# EAGLE design smartInterface_org (EAGLE 9.5.0)

## Sheet 1 of 5: Microcontroller Subsystem
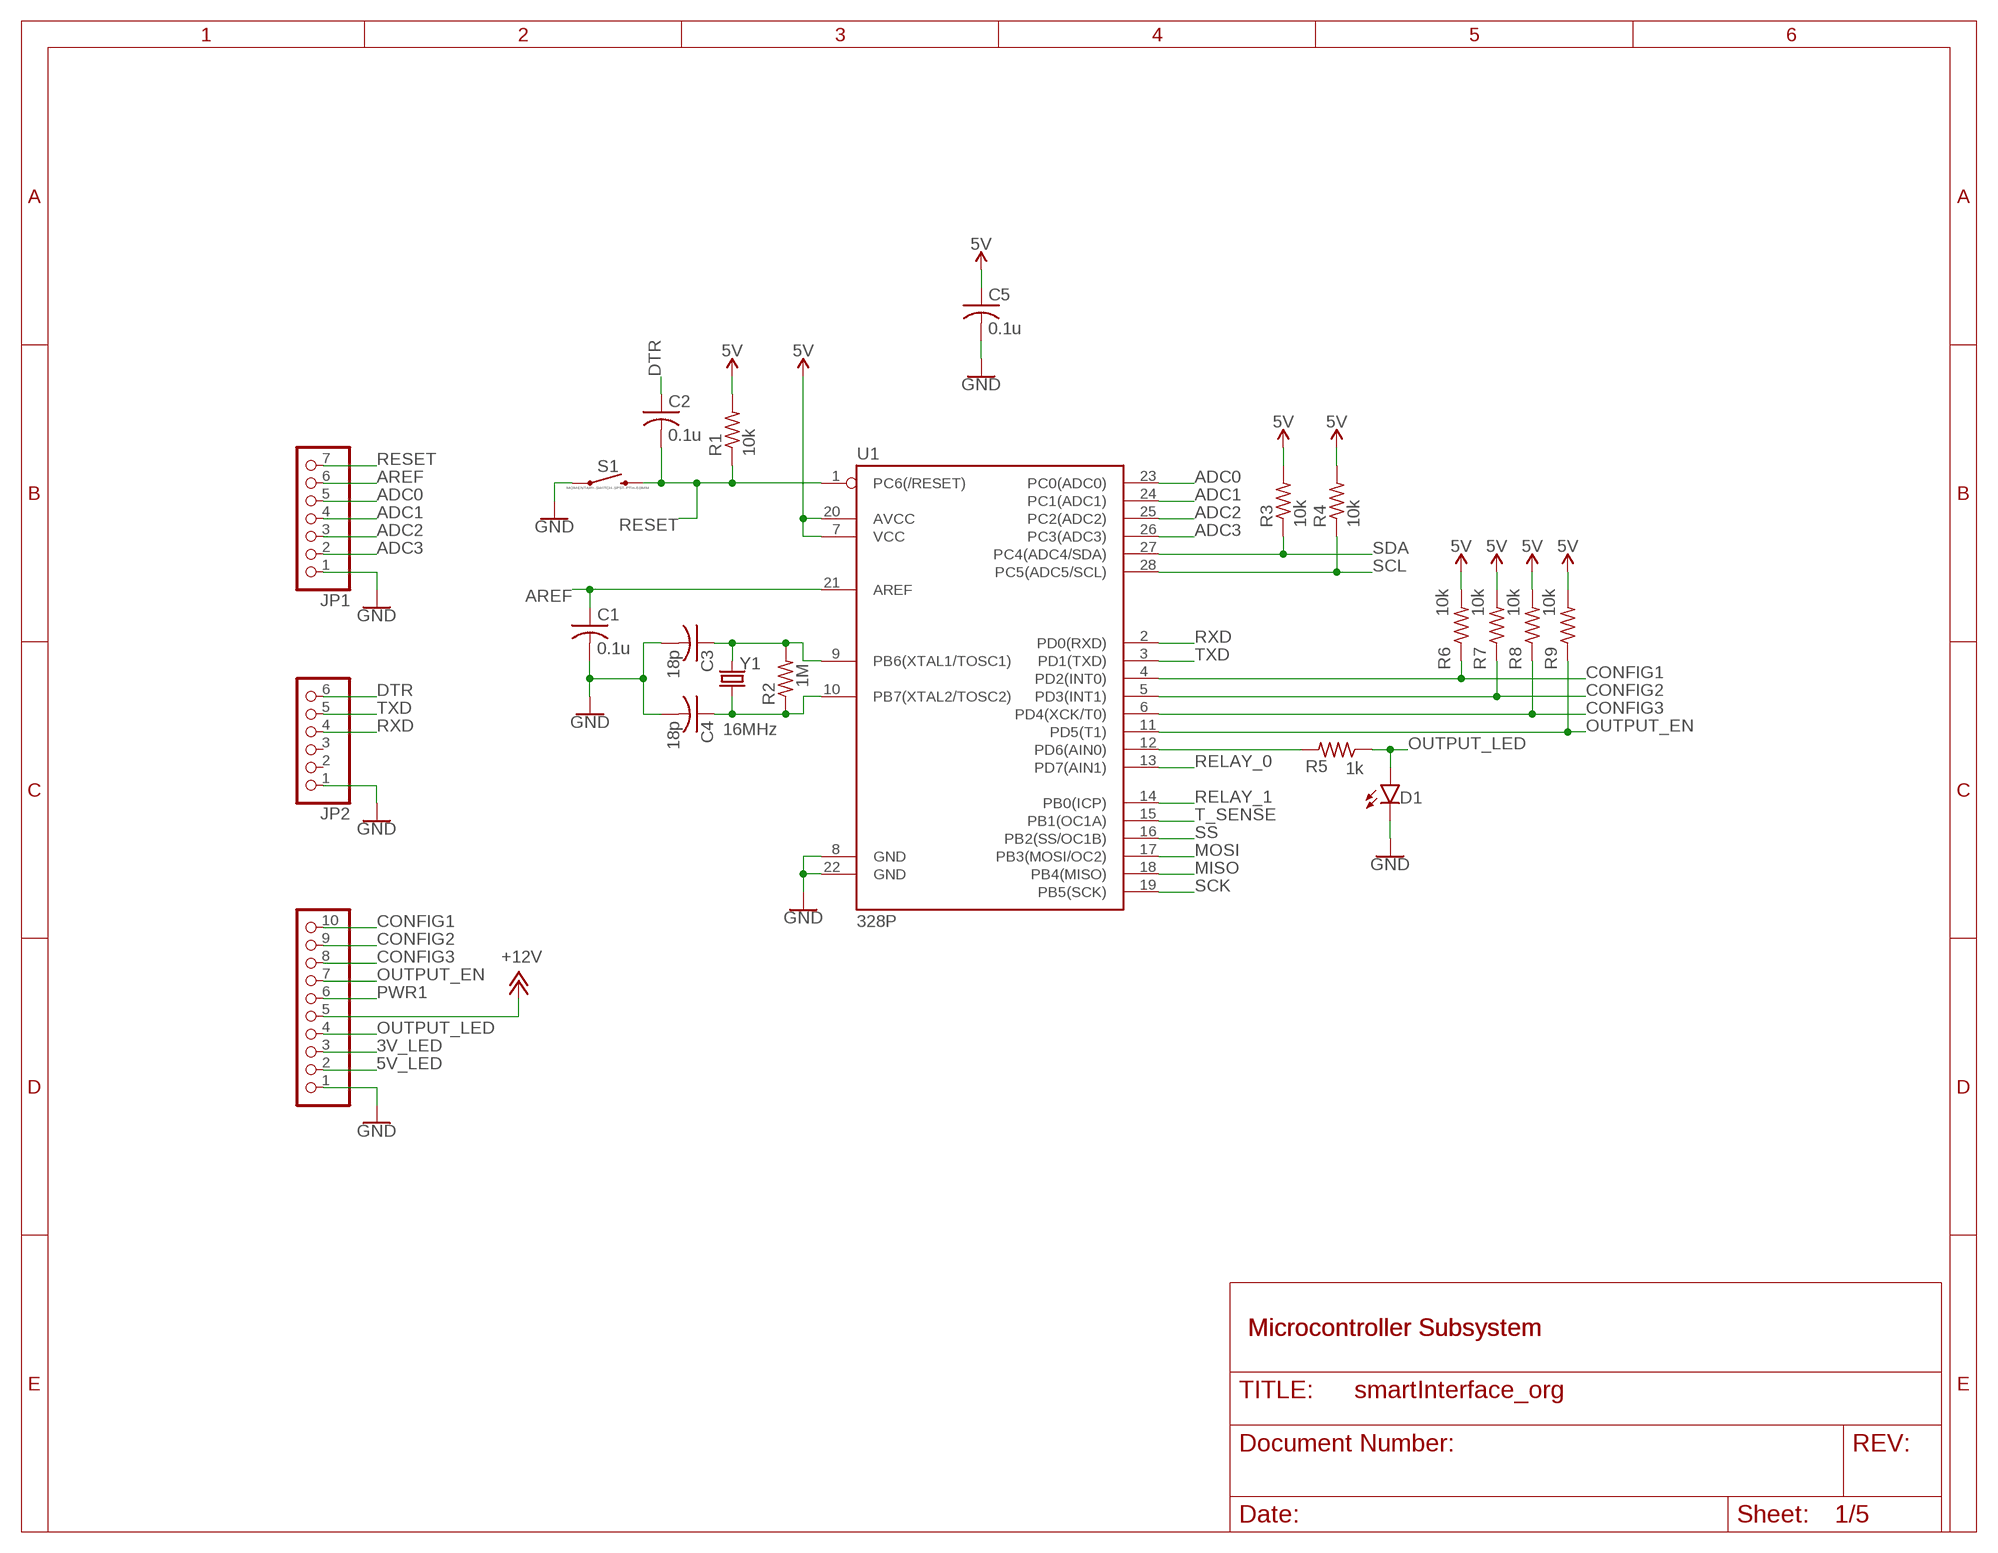
[diagram p0: schematic, sheet 1]

### Parts
C1  0.1u  C-USC0603  [C0603]
C2  0.1u  C-USC0603  [C0603]
C3  18p  C-USC0603  [C0603]
C4  18p  C-USC0603  [C0603]
C5  0.1u  C-USC0603  [C0603]
D1  LED0603  [LED-0603]
JP1  PINHD-1X7  [1X07]
JP2  PINHD-1X6/90  [1X06/90]
JP5  PINHD-1X10  [1X10]
R1  10k  R-US_R0603  [R0603]
R2  1M  R-US_R0603  [R0603]
R3  10k  R-US_R0603  [R0603]
R4  10k  R-US_R0603  [R0603]
R5  1k  R-US_R0603  [R0603]
R6  10k  R-US_R0603  [R0603]
R7  10k  R-US_R0603  [R0603]
R8  10k  R-US_R0603  [R0603]
R9  10k  R-US_R0603  [R0603]
S1  MOMENTARY-SWITCH-SPST-PTH-6.0MM  [TACTILE_SWITCH_PTH_6.0MM]
U1  328P  ATMEGA328P_PDIP  [DIP28]
Y1  16MHz  CRYSTAL-16MHZPTH-HC49US  [HC49US]

### Nets
3V_LED: JP5.3 ; also sheet 5
5V: C5.1 R1.2 R3.2 R4.2 R6.2 R7.2 R8.2 R9.2 U1.7(VCC) U1.20(AVCC) ; also sheet 3,4,5
5V_LED: JP5.2 ; also sheet 5
+12V: JP5.5 ; also sheet 5
ADC0: JP1.5 U1.23(PC0(ADC0))
ADC1: JP1.4 U1.24(PC1(ADC1))
ADC2: JP1.3 U1.25(PC2(ADC2))
ADC3: JP1.2 U1.26(PC3(ADC3))
AREF: C1.1 JP1.6 U1.21(AREF)
CONFIG1: JP5.10 R6.1 U1.4(PD2(INT0))
CONFIG2: JP5.9 R7.1 U1.5(PD3(INT1))
CONFIG3: JP5.8 R8.1 U1.6(PD4(XCK/T0))
DTR: C2.1 JP2.6
GND: C1.2 C3.2 C4.2 C5.2 D1.C JP1.1 JP2.1 JP5.1 S1.1 U1.8(GND) U1.22(GND) ; also sheet 2,3,4,5
MISO: U1.18(PB4(MISO)) ; also sheet 4
MOSI: U1.17(PB3(MOSI/OC2)) ; also sheet 4
N$6: C3.1 R2.2 U1.9(PB6(XTAL1/TOSC1)) Y1.2
N$8: C4.1 R2.1 U1.10(PB7(XTAL2/TOSC2)) Y1.1
N$9: R5.2 U1.12(PD6(AIN0))
OUTPUT_EN: JP5.7 R9.1 U1.11(PD5(T1))
OUTPUT_LED: D1.A JP5.4 R5.1
PWR1: JP5.6 ; also sheet 5
RELAY_0: U1.13(PD7(AIN1)) ; also sheet 2
RELAY_1: U1.14(PB0(ICP)) ; also sheet 2
RESET: C2.2 JP1.7 R1.1 S1.3 U1.1(PC6(/RESET)) ; also sheet 4
RXD: JP2.4 U1.2(PD0(RXD))
SCK: U1.19(PB5(SCK)) ; also sheet 4
SCL: R4.1 U1.28(PC5(ADC5/SCL)) ; also sheet 3
SDA: R3.1 U1.27(PC4(ADC4/SDA)) ; also sheet 3
SS: U1.16(PB2(SS/OC1B)) ; also sheet 4
T_SENSE: U1.15(PB1(OC1A)) ; also sheet 3
TXD: JP2.5 U1.3(PD1(TXD))
Unconnected: JP2.2 JP2.3

### Notes on the sheet
- Microcontroller Subsystem | Microcontroller Subsystem

## Sheet 2 of 5: Switching Subsystem
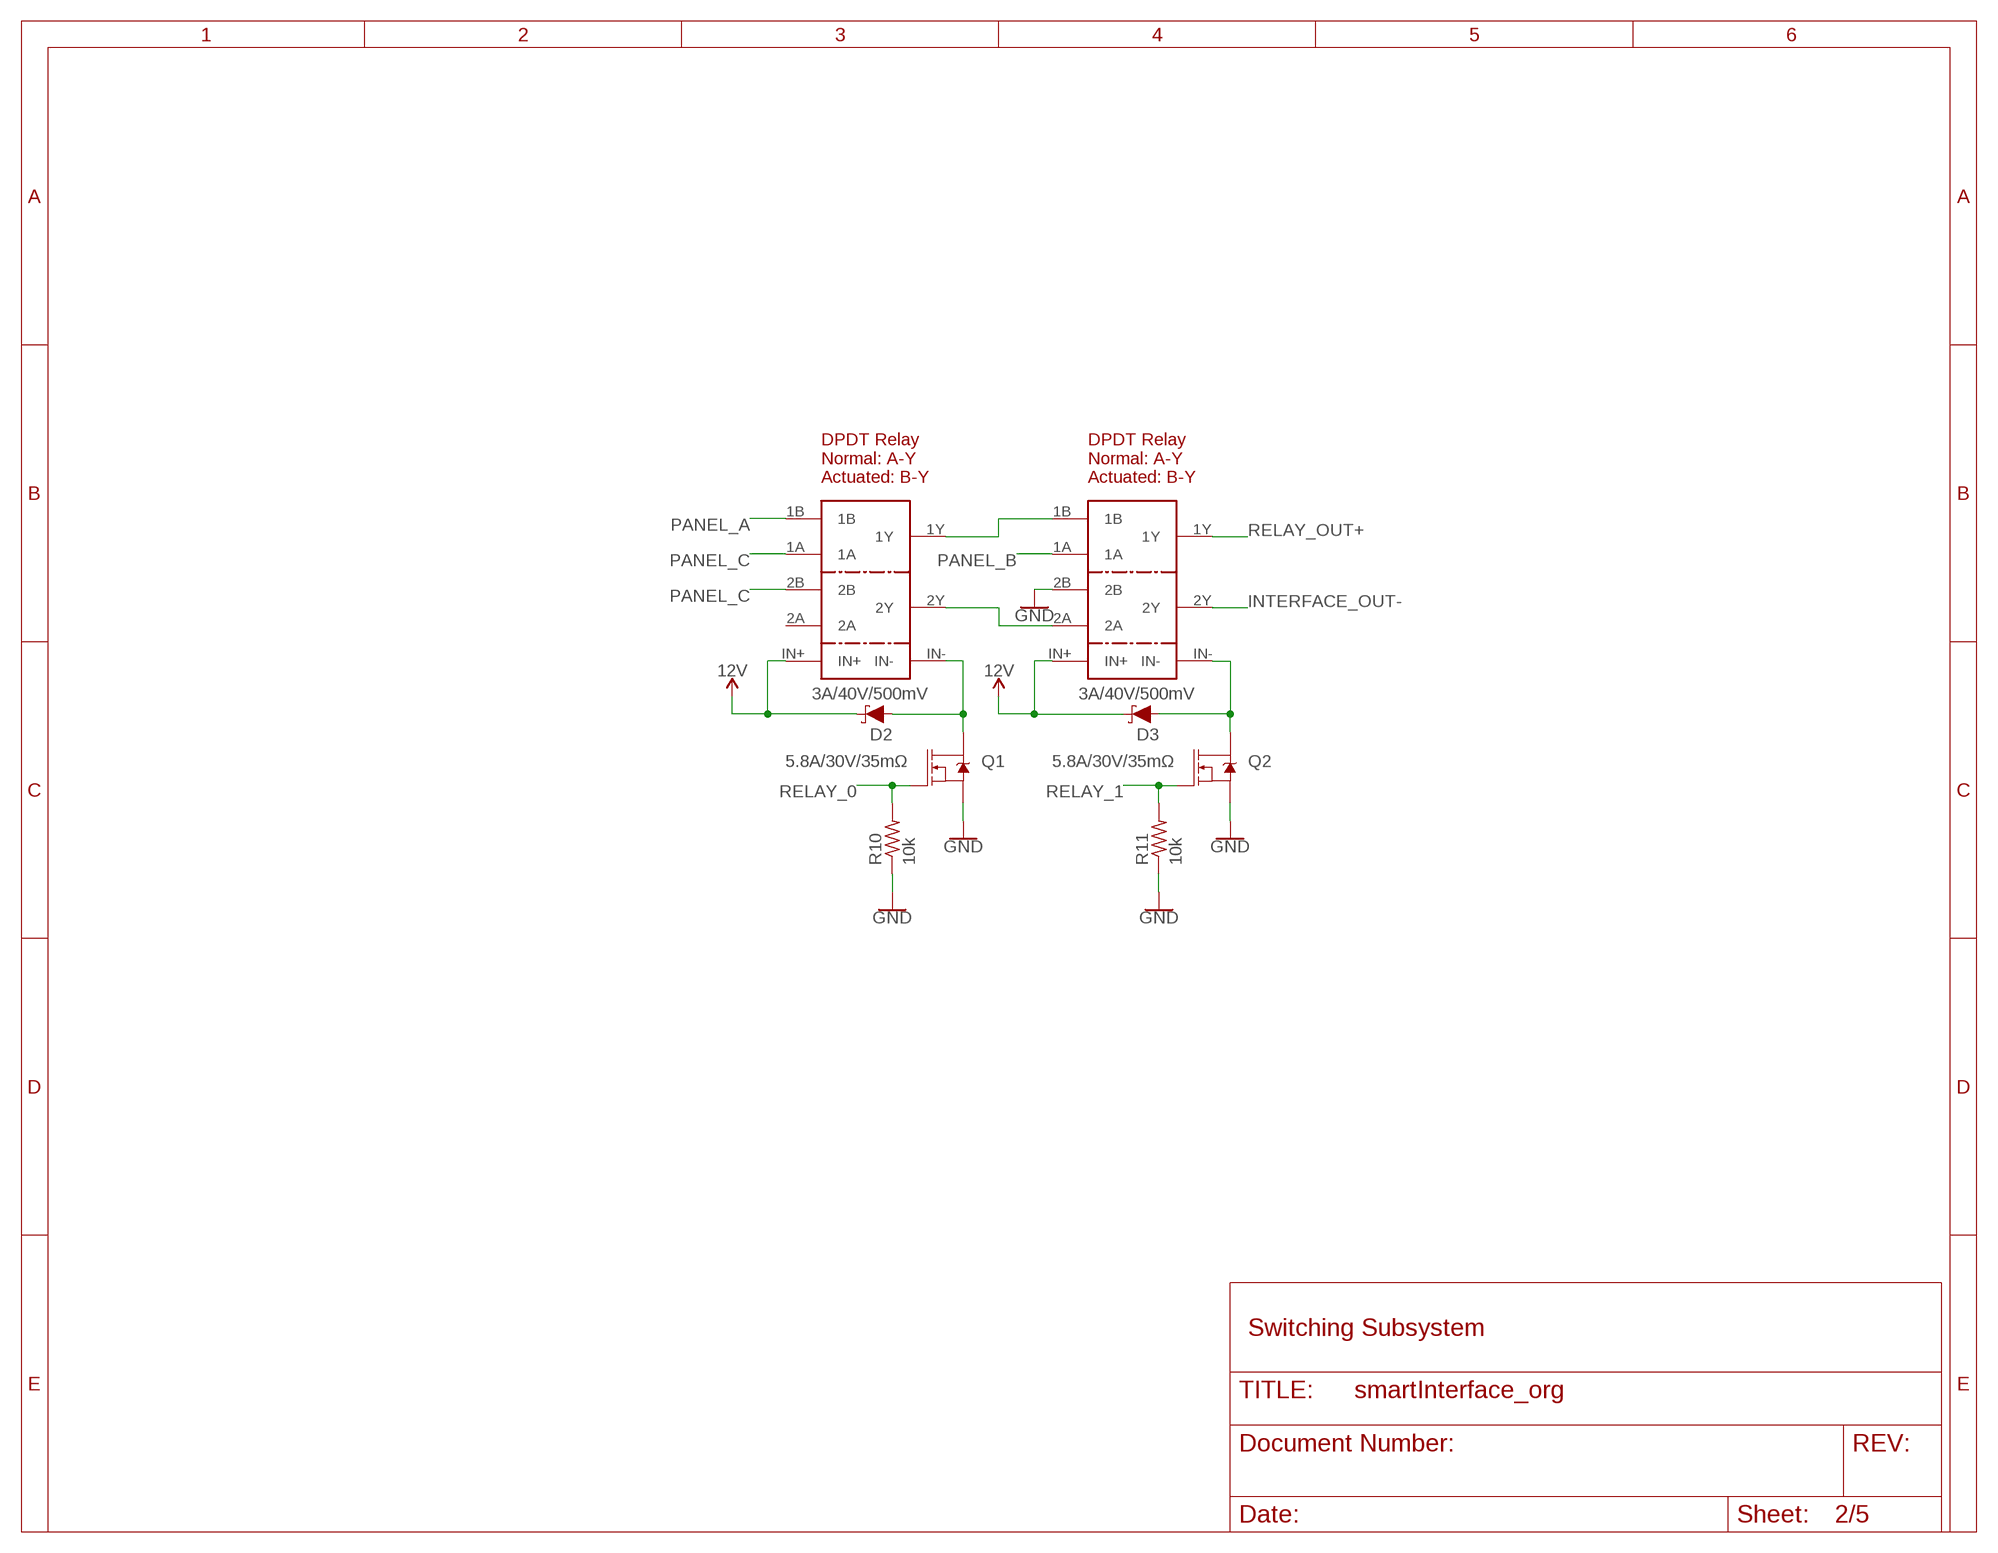
[diagram p1: schematic, sheet 2]

### Parts
D2  3A/40V/500mV  DIODE-SCHOTTKY-B340A  [SMA-DIODE]
D3  3A/40V/500mV  DIODE-SCHOTTKY-B340A  [SMA-DIODE]
K1  DPDT_RELAY  [DPDT_RELAY]
K2  DPDT_RELAY  [DPDT_RELAY]
Q1  5.8A/30V/35mΩ  MOSFET-NCH-AO3404A  [SOT23-3]
Q2  5.8A/30V/35mΩ  MOSFET-NCH-AO3404A  [SOT23-3]
R10  10k  R-US_R0603  [R0603]
R11  10k  R-US_R0603  [R0603]

### Nets
12V: D2.C D3.C K1.IN+ K2.IN+ ; also sheet 5
GND: K2.2B Q1.2(S) Q2.2(S) R10.1 R11.1 ; also sheet 1,3,4,5
INTERFACE_OUT-: K2.2Y ; also sheet 5
N$15: K1.1Y K2.1B
N$16: K1.2Y K2.2A
N$18: D2.A K1.IN- Q1.3(D)
N$21: D3.A K2.IN- Q2.3(D)
PANEL_A: K1.1B ; also sheet 3,5
PANEL_B: K2.1A ; also sheet 3,5
PANEL_C: K1.1A K1.2B ; also sheet 3,5
RELAY_0: Q1.1(G) R10.2 ; also sheet 1
RELAY_1: Q2.1(G) R11.2 ; also sheet 1
RELAY_OUT+: K2.1Y ; also sheet 3
Unconnected: K1.2A

### Notes on the sheet
- DPDT Relay
  Normal: A-Y
  Actuated: B-Y
- DPDT Relay
  Normal: A-Y
  Actuated: B-Y
- Switching Subsystem

## Sheet 3 of 5: Voltage, Current, Temperature Monitoring
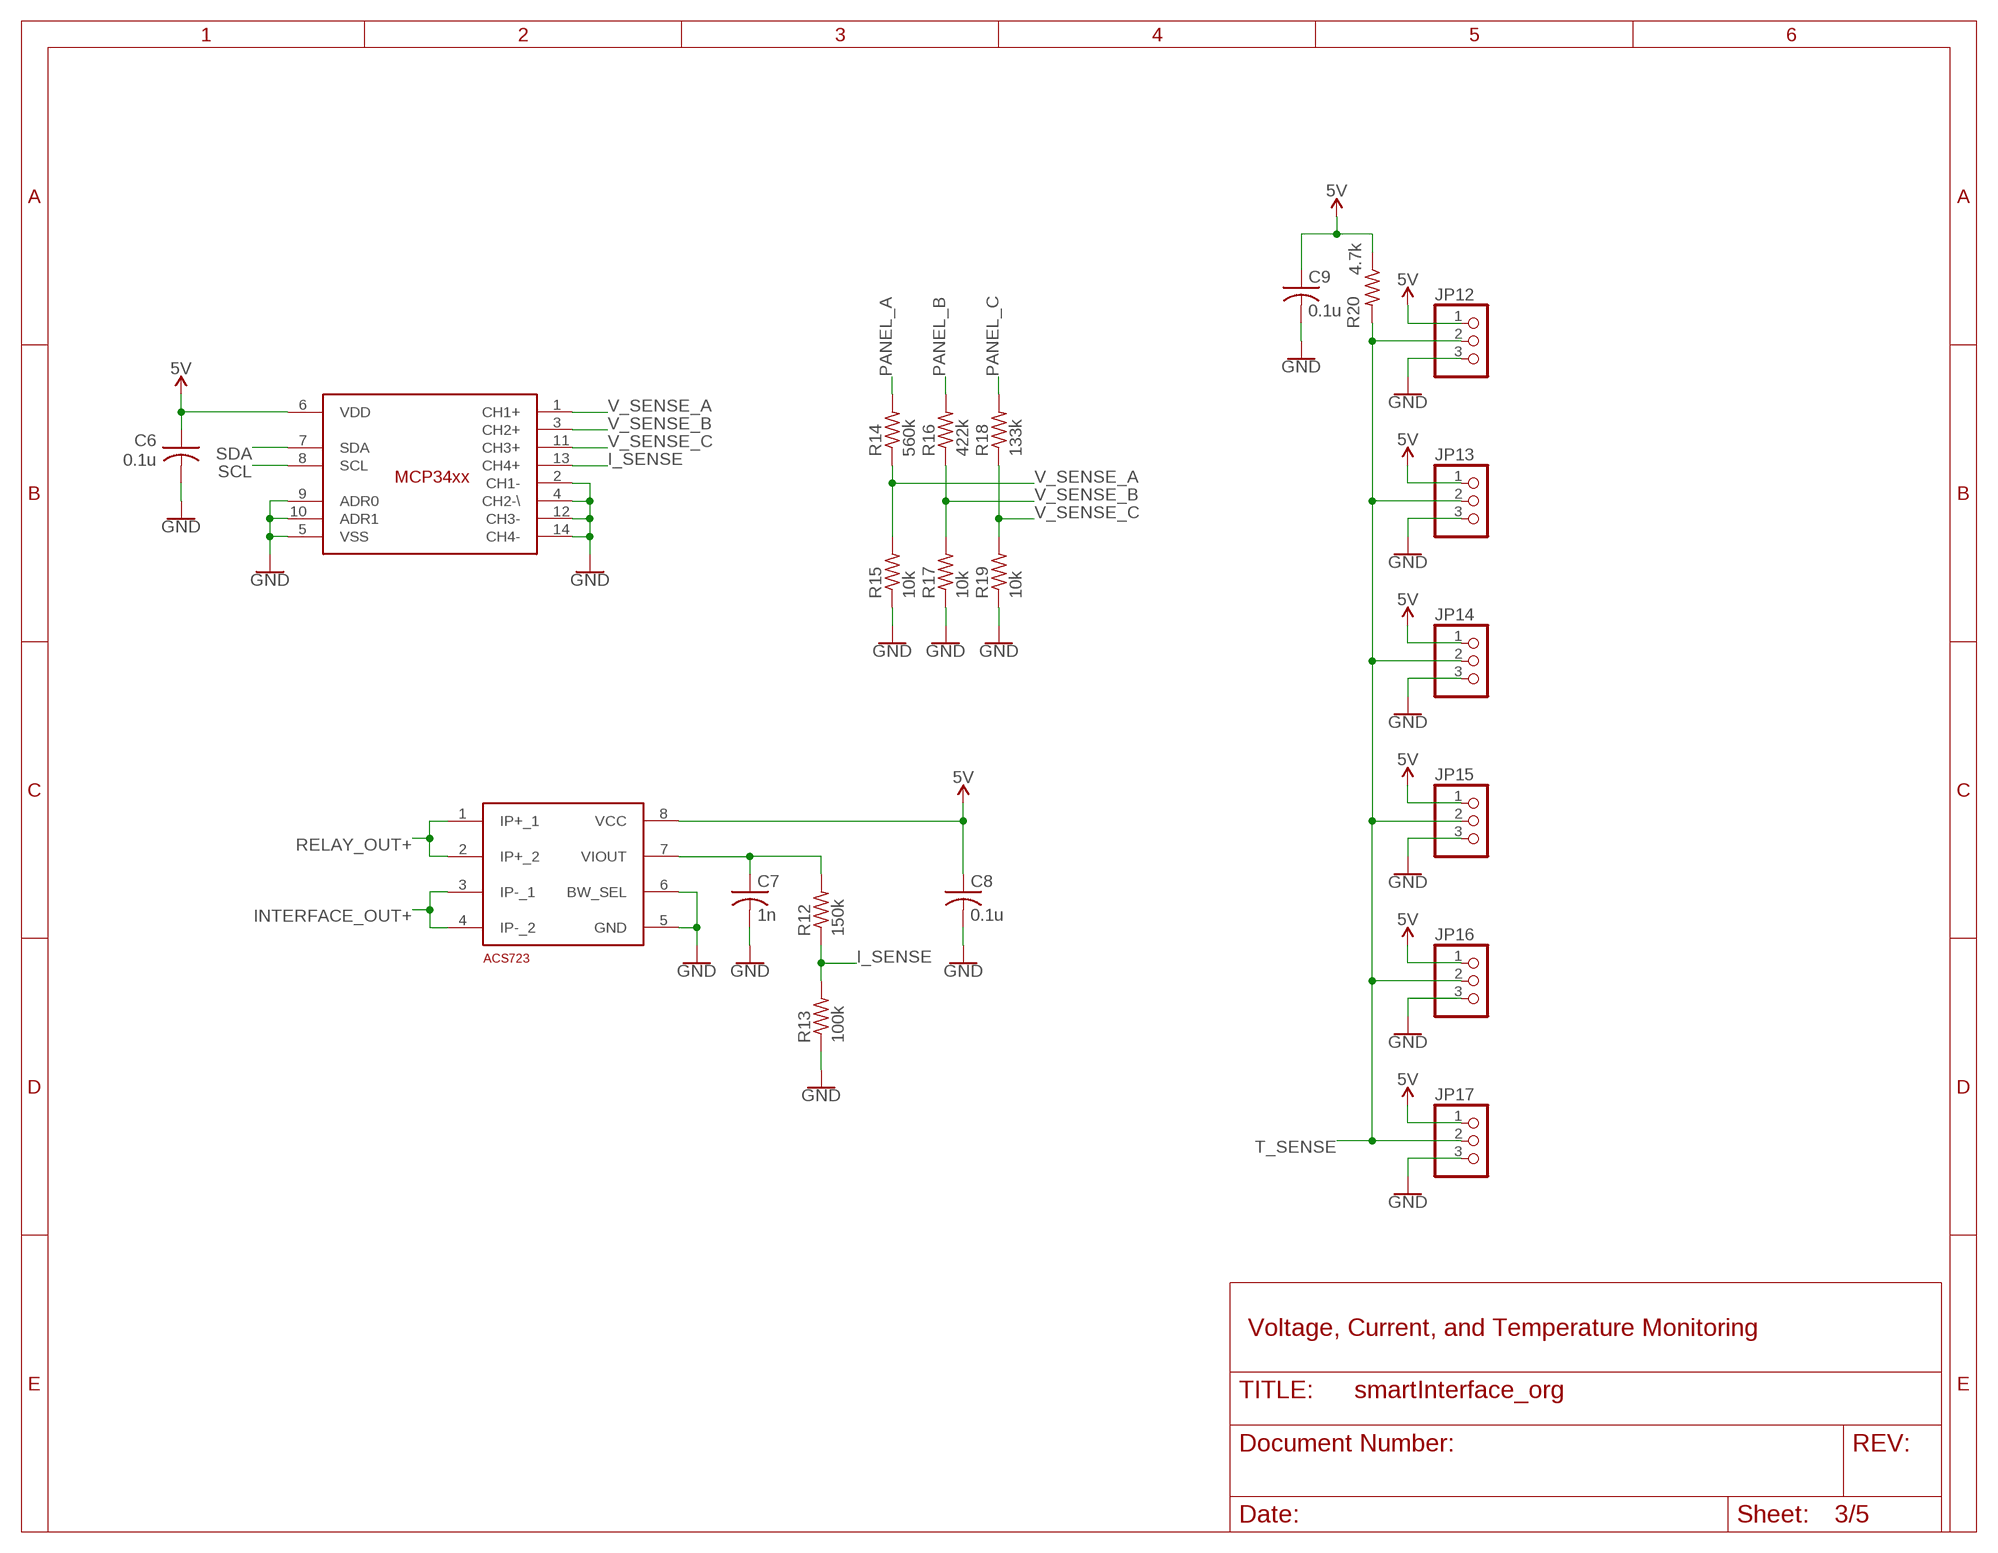
[diagram p2: schematic, sheet 3]

### Parts
C6  0.1u  C-USC0603  [C0603]
C7  1n  C-USC0603  [C0603]
C8  0.1u  C-USC0603  [C0603]
C9  0.1u  C-USC0805  [C0805]
JP12  PINHD-1X3  [1X03]
JP13  PINHD-1X3  [1X03]
JP14  PINHD-1X3  [1X03]
JP15  PINHD-1X3  [1X03]
JP16  PINHD-1X3  [1X03]
JP17  PINHD-1X3  [1X03]
R12  150k  R-US_R0603  [R0603]
R13  100k  R-US_R0603  [R0603]
R14  560k  R-US_R0603  [R0603]
R15  10k  R-US_R0603  [R0603]
R16  422k  R-US_R0603  [R0603]
R17  10k  R-US_R0603  [R0603]
R18  133k  R-US_R0603  [R0603]
R19  10k  R-US_R0603  [R0603]
R20  4.7k  R-US_R0603  [R0603]
U2  MCP3428  [SO14]
U3  ACS723  [SO08]

### Nets
5V: C6.1 C8.1 C9.1 JP12.1 JP13.1 JP14.1 JP15.1 JP16.1 JP17.1 R20.1 U2.6(VDD) U3.8(VCC) ; also sheet 1,4,5
GND: C6.2 C7.2 C8.2 C9.2 JP12.3 JP13.3 JP14.3 JP15.3 JP16.3 JP17.3 R13.1 R15.1 R17.1 R19.1 U2.2(CH1-) U2.4(CH2-\) U2.5(VSS) U2.9(ADR0) U2.10(ADR1) U2.12(CH3-) U2.14(CH4-) U3.5(GND) U3.6(BW_SEL) ; also sheet 1,2,4,5
I_SENSE: R12.1 R13.2 U2.13(CH4+)
INTERFACE_OUT+: U3.3(IP-_1) U3.4(IP-_2) ; also sheet 5
N$22: C7.1 R12.2 U3.7(VIOUT)
PANEL_A: R14.2 ; also sheet 2,5
PANEL_B: R16.2 ; also sheet 2,5
PANEL_C: R18.2 ; also sheet 2,5
RELAY_OUT+: U3.1(IP+_1) U3.2(IP+_2) ; also sheet 2
SCL: U2.8(SCL) ; also sheet 1
SDA: U2.7(SDA) ; also sheet 1
T_SENSE: JP12.2 JP13.2 JP14.2 JP15.2 JP16.2 JP17.2 R20.2 ; also sheet 1
V_SENSE_A: R14.1 R15.2 U2.1(CH1+)
V_SENSE_B: R16.1 R17.2 U2.3(CH2+)
V_SENSE_C: R18.1 R19.2 U2.11(CH3+)

### Notes on the sheet
- Voltage, Current, and Temperature Monitoring

## Sheet 4 of 5: Ethernet Interface
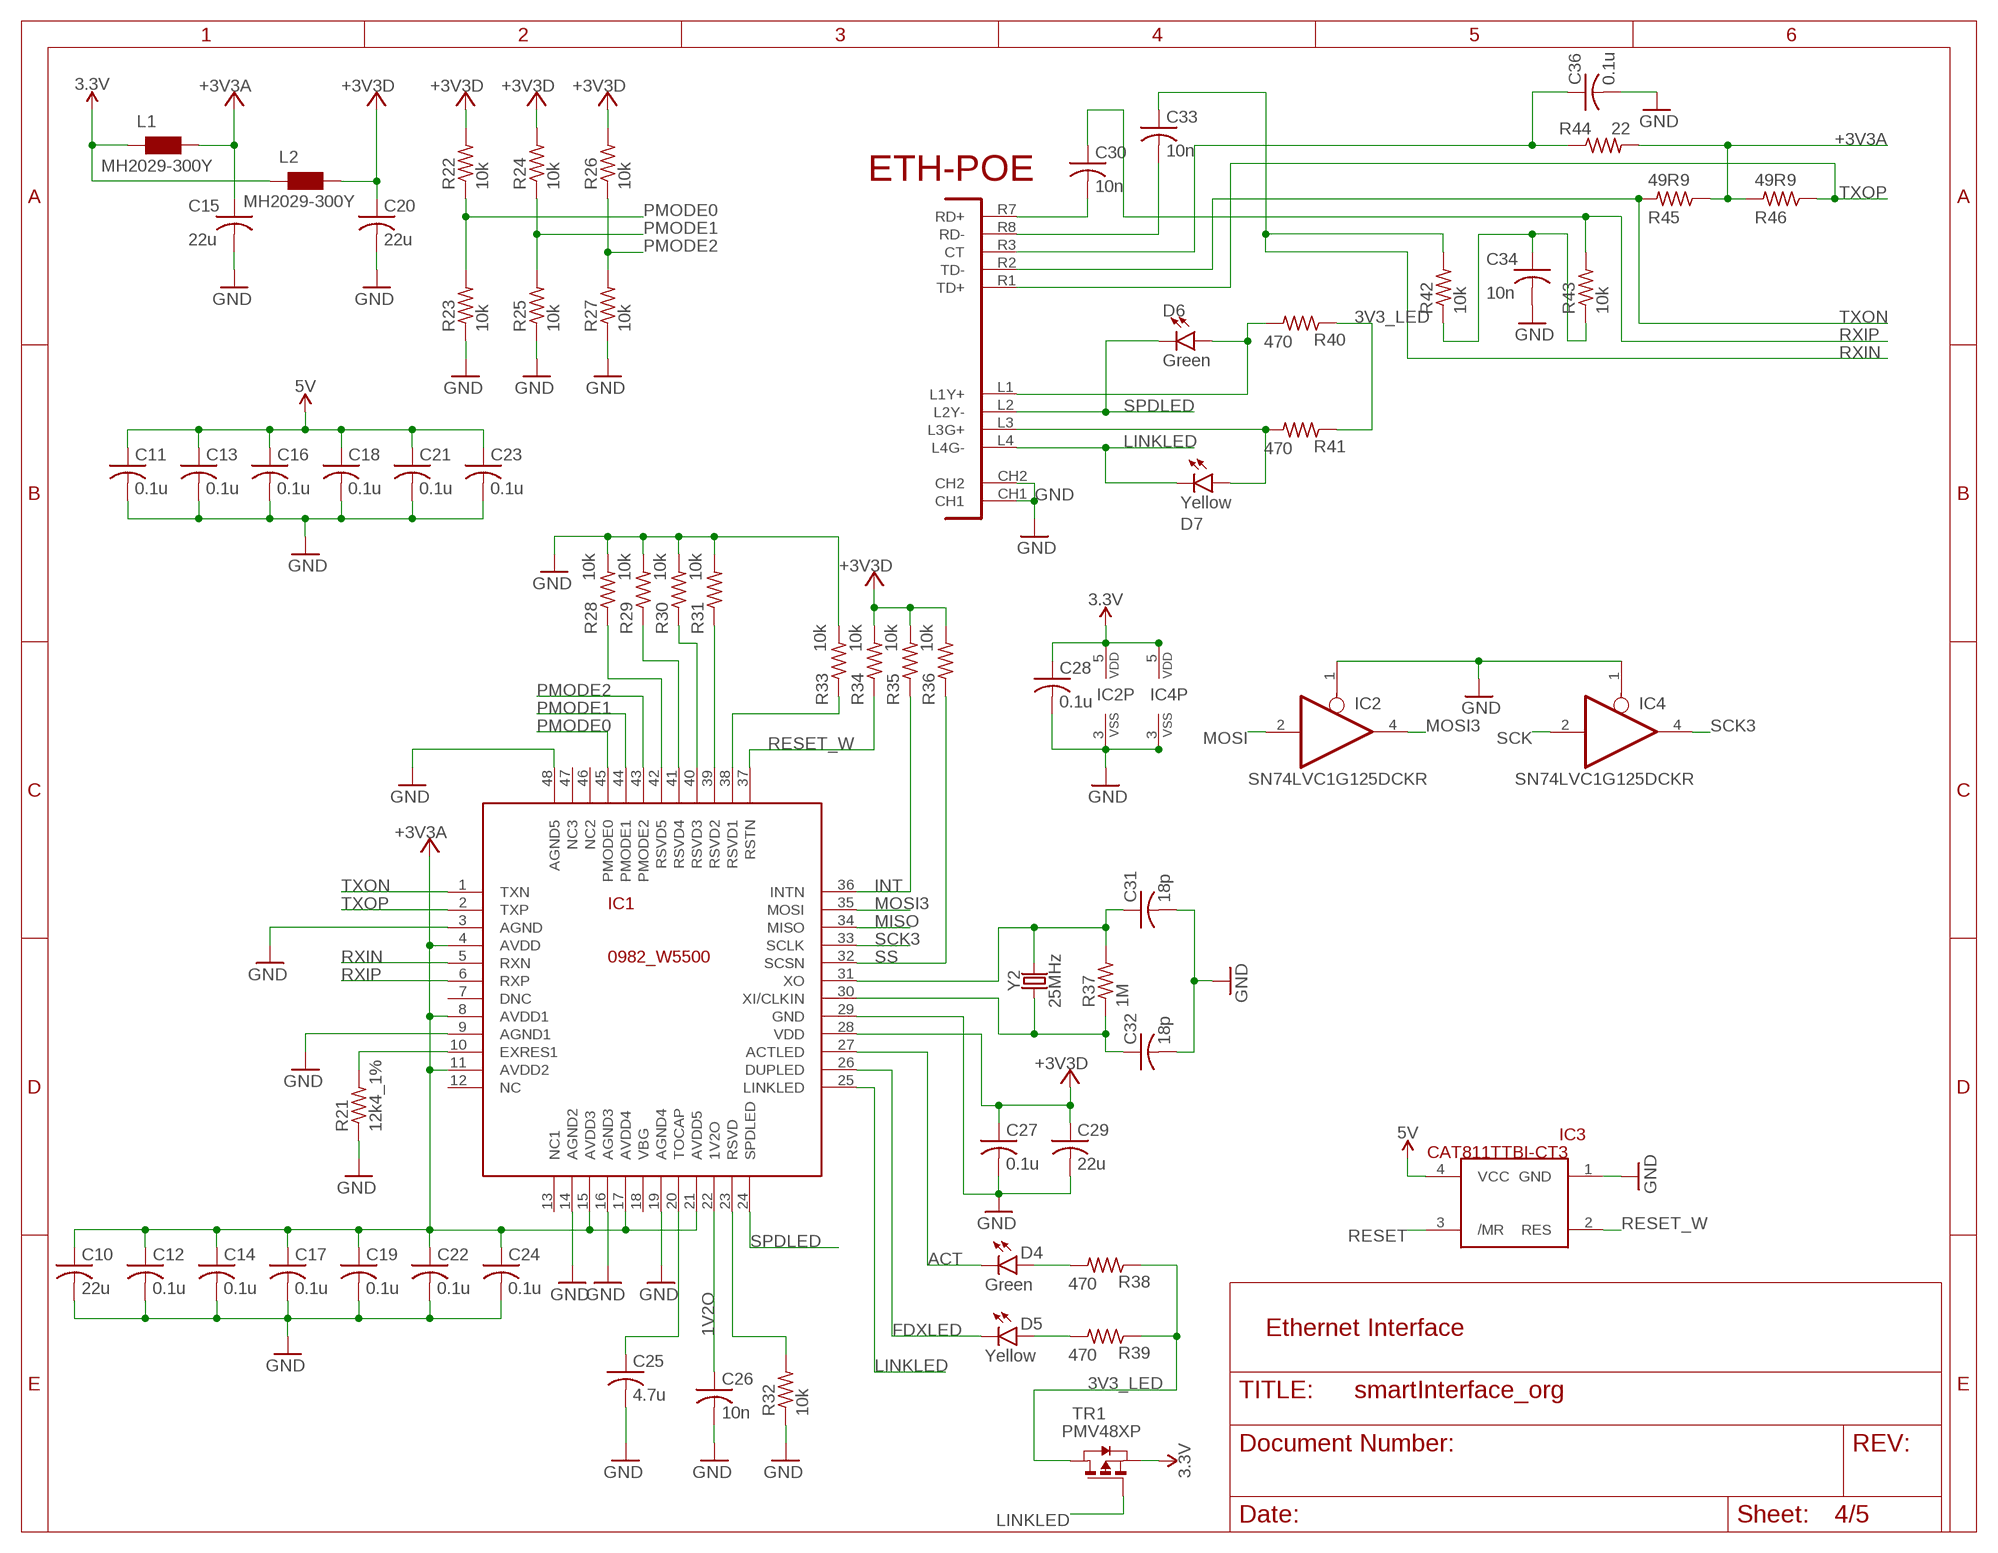
[diagram p3: schematic, sheet 4]

### Parts
C10  22u  C-USC0603  [C0603]
C11  0.1u  C-USC0603  [C0603]
C12  0.1u  C-USC0603  [C0603]
C13  0.1u  C-USC0603  [C0603]
C14  0.1u  C-USC0603  [C0603]
C15  22u  C-USC0603  [C0603]
C16  0.1u  C-USC0603  [C0603]
C17  0.1u  C-USC0603  [C0603]
C18  0.1u  C-USC0603  [C0603]
C19  0.1u  C-USC0603  [C0603]
C20  22u  C-USC0603  [C0603]
C21  0.1u  C-USC0603  [C0603]
C22  0.1u  C-USC0603  [C0603]
C23  0.1u  C-USC0603  [C0603]
C24  0.1u  C-USC0603  [C0603]
C25  4.7u  C-USC0603  [C0603]
C26  10n  C-USC0603  [C0603]
C27  0.1u  C-USC0603  [C0603]
C28  0.1u  C-USC0603  [C0603]
C29  22u  C-USC0603  [C0603]
C30  10n  C-USC0603  [C0603]
C31  18p  C-USC0603  [C0603]
C32  18p  C-USC0603  [C0603]
C33  10n  C-USC0603  [C0603]
C34  10n  C-USC0603  [C0603]
C36  0.1u  C-USC0603  [C0603]
D4  Green  LED0603  [LED-0603]
D5  Yellow  LED0603  [LED-0603]
D6  Green  LED0603  [LED-0603]
D7  Yellow  LED0603  [LED-0603]
ETH1  RB1-125BHQ1A  0033_RB1-125BHQ1A  [POE-RJ45]
IC1  0982_W5500  [TQFP48-7X7]
IC2  SN74LVC1G125DCKR  0040_SN74LVC1G125DCKR  [SC70-5]
IC3  CAT811TTBI-CT3  0035_CAT811TTBI-GT3  [SOT143]
IC4  SN74LVC1G125DCKR  0040_SN74LVC1G125DCKR  [SC70-5]
L1  MH2029-300Y  0001_BLM21PG300SN1D_/_MH2029-300Y  [0805]
L2  MH2029-300Y  0001_BLM21PG300SN1D_/_MH2029-300Y  [0805]
R21  12k4_1%  R-US_R0603  [R0603]
R22  10k  R-US_R0603  [R0603]
R23  10k  R-US_R0603  [R0603]
R24  10k  R-US_R0603  [R0603]
R25  10k  R-US_R0603  [R0603]
R26  10k  R-US_R0603  [R0603]
R27  10k  R-US_R0603  [R0603]
R28  10k  R-US_R0603  [R0603]
R29  10k  R-US_R0603  [R0603]
R30  10k  R-US_R0603  [R0603]
R31  10k  R-US_R0603  [R0603]
R32  10k  R-US_R0603  [R0603]
R33  10k  R-US_R0603  [R0603]
R34  10k  R-US_R0603  [R0603]
R35  10k  R-US_R0603  [R0603]
R36  10k  R-US_R0603  [R0603]
R37  1M  R-US_R0603  [R0603]
R38  470  R-US_R0603  [R0603]
R39  470  R-US_R0603  [R0603]
R40  470  R-US_R0603  [R0603]
R41  470  R-US_R0603  [R0603]
R42  10k  R-US_R0603  [R0603]
R43  10k  R-US_R0603  [R0603]
R44  22  R-US_R0603  [R0603]
R45  49R9  R-US_R0603  [R0603]
R46  49R9  R-US_R0603  [R0603]
TR1  PMV48XP  0297_PMV48XP  [SOT-23]
Y2  25MHz  CRYSTAL-16MHZPTH-HC49US  [HC49US]

### Nets
1V2O: C26.1 IC1.22(1V2O)
3.3V: C28.1 IC2.5(VDD) IC4.5(VDD) L1.1 L2.1 TR1.2(S) ; also sheet 5
3V3_LED [power]: R38.1 R39.1 R40.1 R41.1 TR1.1(D)
5V: C11.1 C13.1 C16.1 C18.1 C21.1 C23.1 IC3.4(VCC) ; also sheet 1,3,5
+3V3A [power]: C10.1 C12.1 C14.1 C15.1 C17.1 C19.1 C22.1 C24.1 IC1.4(AVDD) IC1.8(AVDD1) IC1.11(AVDD2) IC1.15(AVDD3) IC1.17(AVDD4) IC1.21(AVDD5) L1.2 R44.2 R45.1 R46.2
+3V3D: C20.1 C27.1 C29.1 IC1.28(VDD) L2.2 R22.2 R24.2 R26.2 R34.2 R35.2 R36.2
ACT: D4.C IC1.27(ACTLED)
FDXLED: D5.C IC1.26(DUPLED)
GND: C10.2 C11.2 C12.2 C13.2 C14.2 C15.2 C16.2 C17.2 C18.2 C19.2 C20.2 C21.2 C22.2 C23.2 C24.2 C25.2 C26.2 C27.2 C28.2 C29.2 C31.2 C32.2 C34.2 C36.2 ETH1.CH1 ETH1.CH2 IC1.3(AGND) IC1.9(AGND1) IC1.14(AGND2) IC1.16(AGND3) IC1.19(AGND4) IC1.29(GND) IC1.48(AGND5) IC2.1(OE) IC2.3(VSS) IC3.1(GND) IC4.1(OE) IC4.3(VSS) R21.1 R23.1 R25.1 R27.1 R28.2 R29.2 R30.2 R31.2 R32.1 R33.2 ; also sheet 1,2,3,5
INT: IC1.36(INTN) R35.1
LINKLED: D7.C ETH1.L4(L4G-) IC1.25(LINKLED) TR1.3(G)
MISO: IC1.34(MISO) ; also sheet 1
MOSI: IC2.2(I) ; also sheet 1
MOSI3: IC1.35(MOSI) IC2.4(O)
N$17: C31.1 IC1.31(XO) R37.2 Y2.2
N$19: IC1.39(RSVD2) R31.1
N$20: D4.A R38.2
N$24: IC1.23(RSVD) R32.2
N$25: D7.A ETH1.L3(L3G+) R41.2
N$26: D6.A ETH1.L1(L1Y+) R40.2
N$27: C34.1 R42.1 R43.1
N$28: C30.2 ETH1.R7(RD+)
N$29: C33.2 ETH1.R8(RD-)
N$30: D5.A R39.2
N$31: IC1.40(RSVD3) R30.1
N$35: IC1.41(RSVD4) R29.1
N$36 [power]: C36.1 ETH1.R3(CT) R44.1
N$37: IC1.42(RSVD5) R28.1
N$38: C25.1 IC1.20(TOCAP)
N$39: IC1.38(RSVD1) R33.1
N$40: IC1.10(EXRES1) R21.2
OSC2E2: C32.1 IC1.30(XI/CLKIN) R37.1 Y2.1
PMODE0: IC1.45(PMODE0) R22.1 R23.2
PMODE1: IC1.44(PMODE1) R24.1 R25.2
PMODE2: IC1.43(PMODE2) R26.1 R27.2
RESET: IC3.3(/MR) ; also sheet 1
RESET_W: IC1.37(RSTN) IC3.2(RES) R34.1
RXIN: C33.1 IC1.5(RXN) R42.2
RXIP: C30.1 IC1.6(RXP) R43.2
SCK: IC4.2(I) ; also sheet 1
SCK3: IC1.33(SCLK) IC4.4(O)
SPDLED: D6.C ETH1.L2(L2Y-) IC1.24(SPDLED)
SS: IC1.32(SCSN) R36.1 ; also sheet 1
TXON: ETH1.R2(TD-) IC1.1(TXN) R45.2
TXOP: ETH1.R1(TD+) IC1.2(TXP) R46.1
Unconnected: IC1.7(DNC) IC1.13(NC1) IC1.18(VBG) IC1.46(NC2) IC1.47(NC3)

### Notes on the sheet
- ETH-POE
- Ethernet Interface

## Sheet 5 of 5: Power Subsystem
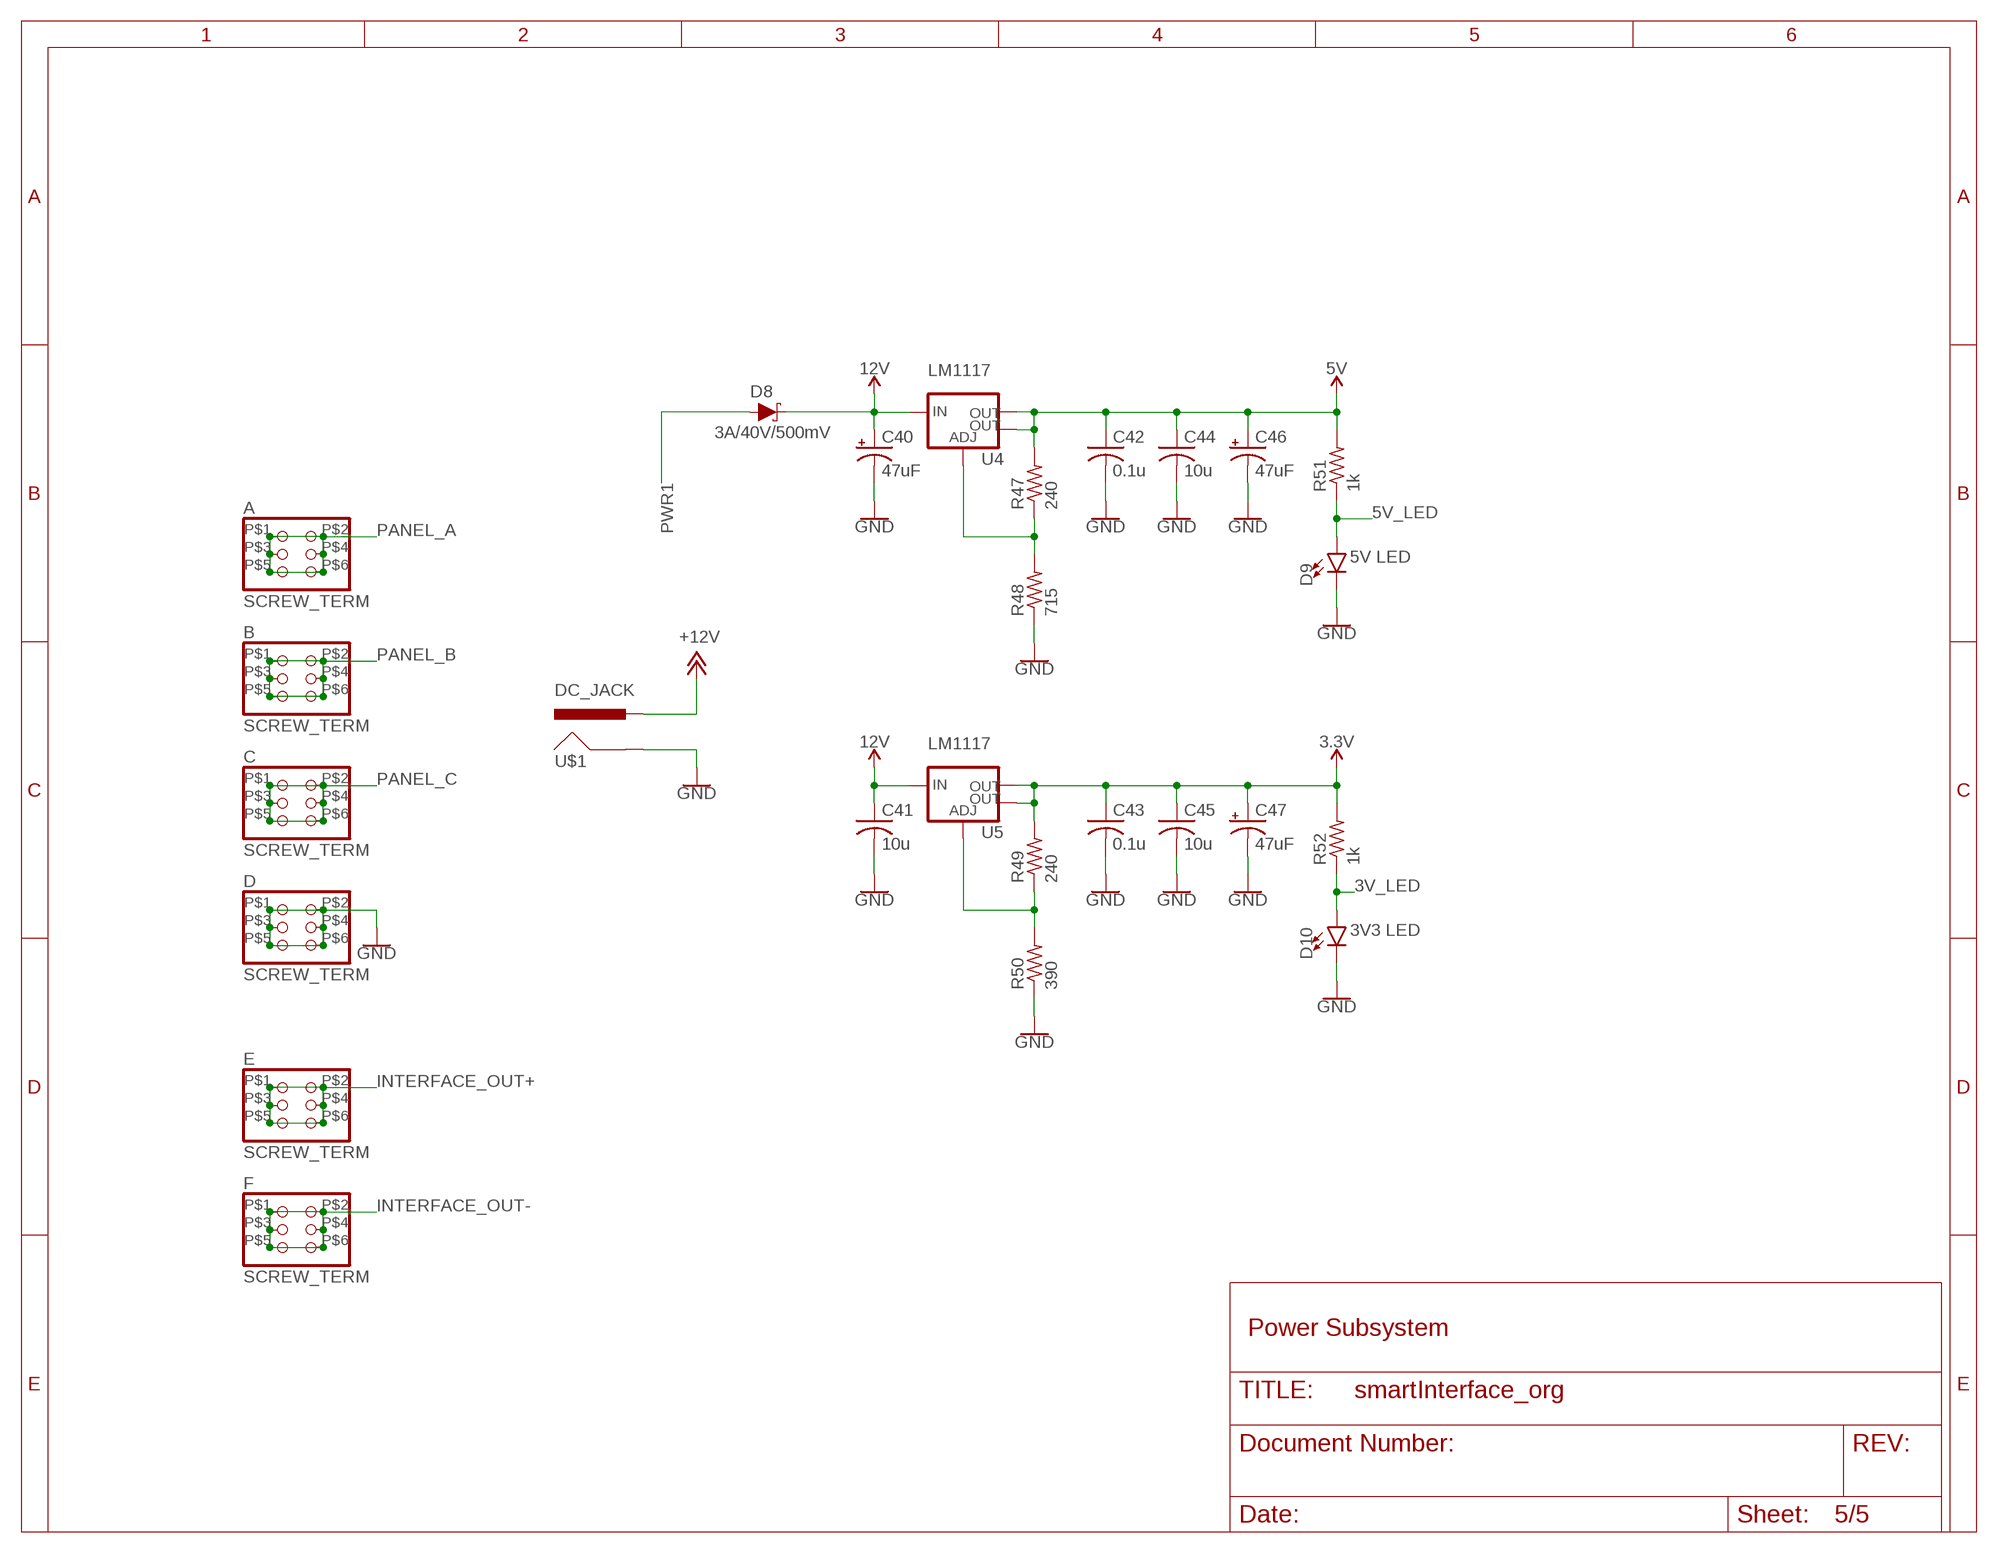
[diagram p4: schematic, sheet 5]

### Parts
A  SCREW_TERM  [SCREW_TERM]
B  SCREW_TERM  [SCREW_TERM]
C  SCREW_TERM  [SCREW_TERM]
C40  47uF  47UF-POLAR-PANASONIC_D-35V-20%  [PANASONIC_D]
C41  10u  C-USC0805  [C0805]
C42  0.1u  C-USC0603  [C0603]
C43  0.1u  C-USC0603  [C0603]
C44  10u  C-USC0805  [C0805]
C45  10u  C-USC0805  [C0805]
C46  47uF  47UF-POLAR-PANASONIC_D-35V-20%  [PANASONIC_D]
C47  47uF  47UF-POLAR-PANASONIC_D-35V-20%  [PANASONIC_D]
D  SCREW_TERM  [SCREW_TERM]
D8  3A/40V/500mV  DIODE-SCHOTTKY-B340A  [SMA-DIODE]
D9  5V LED  LED0603  [LED-0603]
D10  3V3 LED  LED0603  [LED-0603]
E  SCREW_TERM  [SCREW_TERM]
F  SCREW_TERM  [SCREW_TERM]
R47  240  R-US_R0603  [R0603]
R48  715  R-US_R0603  [R0603]
R49  240  R-US_R0603  [R0603]
R50  390  R-US_R0603  [R0603]
R51  1k  R-US_R0603  [R0603]
R52  1k  R-US_R0603  [R0603]
U4  LM1117  V_REG_LM1117SOT223  [SOT223]
U5  LM1117  V_REG_LM1117SOT223  [SOT223]
U$1  DC_JACK  [POWER_JACK_PTH]

### Nets
3.3V: C43.1 C45.1 C47.+ R49.2 R52.2 U5.2(OUT) U5.4(OUT) ; also sheet 4
3V_LED: D10.A R52.1 ; also sheet 1
5V: C42.1 C44.1 C46.+ R47.2 R51.2 U4.2(OUT) U4.4(OUT) ; also sheet 1,3,4
5V_LED: D9.A R51.1 ; also sheet 1
12V: C40.+ C41.1 D8.C U4.3(IN) U5.3(IN) ; also sheet 2
+12V: U$1.PWR ; also sheet 1
GND: C40.- C41.2 C42.2 C43.2 C44.2 C45.2 C46.- C47.- D9.C D10.C D.P$1 D.P$2 D.P$3 D.P$4 D.P$5 D.P$6 R48.1 R50.1 U$1.GND ; also sheet 1,2,3,4
INTERFACE_OUT+: E.P$1 E.P$2 E.P$3 E.P$4 E.P$5 E.P$6 ; also sheet 3
INTERFACE_OUT-: F.P$1 F.P$2 F.P$3 F.P$4 F.P$5 F.P$6 ; also sheet 2
N$2: R47.1 R48.2 U4.1(ADJ)
N$3: R49.1 R50.2 U5.1(ADJ)
PANEL_A: A.P$1 A.P$2 A.P$3 A.P$4 A.P$5 A.P$6 ; also sheet 2,3
PANEL_B: B.P$1 B.P$2 B.P$3 B.P$4 B.P$5 B.P$6 ; also sheet 2,3
PANEL_C: C.P$1 C.P$2 C.P$3 C.P$4 C.P$5 C.P$6 ; also sheet 2,3
PWR1: D8.A ; also sheet 1

### Notes on the sheet
- Power Subsystem

## Power pins joined to a net without a drawn wire
NC: IC1.12(NC)

## Library data of the parts
A B C D E F = ece445:SCREW_TERM
C1-C34 C36 C41-C45 = rcl:C-US: CAPACITOR, American symbol; SPICEPREFIX: C
C40 C46 C47 = SparkFun-Capacitors:47UF-POLAR: 47µF polarized capacitors A capacitor is a passive two-terminal electrical component used to store electrical energy temporarily in an electric field.; PROD_ID: CAP-08478
D1 D4-D7 D9 D10 = SparkFun-LED:LED: LED (Generic) Standard schematic elements and footprints for 5mm, 3mm, 1206, and 0603 sized LEDs. Generic LEDs with no color specified.
D2 D3 D8 = SparkFun-DiscreteSemi:DIODE-SCHOTTKY: Schottky diode A Schottky diode is a semiconductor diode which has a low forward voltage drop and a very fast switching action.; PROD_ID: DIO-09886
ETH1 = ece445:0033_RB1-125BHQ1A: RB1-125BHQ1A; MONTHLY_USAGE: _____; PART_NUMBER: RB1-125BHQ1A; PRICE: _____; SUPPLIER: _____; TYPE: Connettori
IC1 = Circuito Integrato:0982_W5500: The W5500 chip is a Hardwired TCP/IP embedded Ethernet controller that enables easier internet connection for embedded systems using SPI (Serial Peripheral Interface). Case TQFP48; PART_NUMBER: W5500
IC2 IC4 = Circuito Integrato:0040_SN74LVC1G125DCKR: Single bus buffer with 3-state output; CASE: SC70; MONTHLY_USAGE: _____; PART_NUMBER: SN74LVC1G125DCKR; PRICE: _____; SUPPLIER: _____; TYPE: Circuito_Integrato; VALUE: 74LVC1G125DCKR
IC3 = Circuito Integrato:0035_CAT811TTBI-GT3: 4-Pin Microprocessor Power Supply Supervisors- Reset Controller CAT811TTBI-GT3; CASE: SOT143-4; MONTHLY_USAGE: 10756.97; PART_NUMBER: CAT811TTBI-GT3; PRICE: _0.15; SUPPLIER: La_Tecnika_Due_s.r.l.; TYPE: Circuito_Integrato; VALUE: CAT811TTBI-GT3
JP1 = pinhead:PINHD-1X7: PIN HEADER
JP2 = pinhead:PINHD-1X6: PIN HEADER
JP5 = pinhead:PINHD-1X10: PIN HEADER
JP12-JP17 = ece445:PINHD-1X3: PIN HEADER
K1 K2 = ece445:DPDT_RELAY
L1 L2 = Protezione:0001_BLM21PG300SN1D_/_MH2029-300Y: BLM21; MONTHLY_USAGE: _____; PART_NUMBER: BLM21PG300SN1D_/_MH2029-300Y; PRICE: _____; SUPPLIER: _____; TYPE: Protezione
Q1 Q2 = SparkFun-DiscreteSemi:MOSFET-NCH: N-channel MOSFETs Voltage controlled devices that allow control of high current outputs. SparkFun Products: SparkFun OpenScale <https://www.sparkfun.com/products/13261> SparkFun Digital Sandbox <https://www.sparkfun.com/products/12651> SparkFun Monster Moto Shield <https://www.sparkfun.com/products/10182> SparkFun MOSFET Power Controller <https://www.sparkfun.com/products/11214>; PROD_ID: TRANS-12988
R1-R52 = rcl:R-US_: RESISTOR, American symbol; SPICEPREFIX: R
S1 = SparkFun-Switches:MOMENTARY-SWITCH-SPST: Momentary Switch (Pushbutton) - SPST Normally-open (NO) SPST momentary switches (buttons, pushbuttons). Variants PTH-12MM - 12mm square, through-hole Momentary Pushbutton Switch - 12mm Square <https://www.sparkfun.com/products/9190> (COM-09190) PTH-6.0MM, PTH-6.0MM-KIT - 6.0mm square, through-hole Mini Pushbutton Switch <https://www.sparkfun.com/products/97> (COM-00097) KIT package intended for soldering kit's - only one side of pads' copper is exposed. PTH-RIGHT-ANGLE-KIT - Right-angle, through-hole Right Angle Tactile Button <https://www.sparkfun.com/products/10791> - Used on SparkFun BigTime Watch Kit <https://www.sparkfun.com/products/11734> SMD-12MM - 12mm square, surface-mount Tactile Button - SMD (12mm) <https://www.sparkfun.com/products/12993> (COM-12993) Used on SparkFun PicoBoard <https://www.sparkfun.com/products/11888> SMD-4.5MM - 4.5mm Square Trackball Switch Used on SparkFun Blackberry Trackballer Breakout <https://www.sparkfun.com/products/13169> SMD-4.6MMX2.8MM - 4.60mm x 2.80mm, surface mount Used on SparkFun SAMD21 Mini Breakout <https://www.sparkfun.com/products/13664> SMD-5.2MM, SMD-5.2-REDUNDANT - 5.2mm square, surface-mount Mini Pushbutton Switch - SMD <https://www.sparkfun.com/products/8720> (COM-08720) Used on Arduino Pro Mini <https://www.sparkfun.com/products/11114> REDUNDANT package connects both switch circuits together SMD-6.0X3.5MM - 6.0 x 3.5mm, surface mount Momentary Reset Switch SMD <https://www.sparkfun.com/products/8229> (COM-08229) SMD-6.2MM-TALL - 6.2mm square, surface mount Tactile Button - SMD (6mm) <https://www.sparkfun.com/products/12992> Used on SparkFun Digital Sandbox <https://www.sparkfun.com/products/12651> SMD-RIGHT-ANGLE - Right-angle, surface mount Used on SparkFun Block for Intel® Edison - Arduino <https://www.sparkfun.com/products/13036>; PROD_ID: SWCH-08441; SF_SKU: COM-00097
TR1 = Transistors:0297_PMV48XP: 20 V, 3.5 A P-channel Trench MOSFET - PMV48XP; CASE: SOT23; MONTHLY_USAGE: _____; PART_NUMBER: PMV48XP; PRICE: _____; SUPPLIER: _____; TYPE: Transistor
U1 = SparkFun-IC-Microcontroller:ATMEGA328P_PDIP: Atmel 328P Through hole ATMEGA328P uC used in the Arduino 32kb flash, 1k EEPROM, 2k SRAM Datasheet <http://www.sparkfun.com/datasheets/Components/SMD/ATMega328.pdf> SparkFun Products Storefront component: AVR 28 Pin 20MHz 32K 6A/D - ATMega328P <https://www.sparkfun.com/products/9061> (COM-09061) SparkFun Simon Says - Through-Hole Soldering Kit <https://www.sparkfun.com/products/10547> (KIT-10547) SparkFun Learn to Solder - Simon Says <https://www.sparkfun.com/products/13708> (KIT-13708) SparkFun BigTime Watch Kit <https://www.sparkfun.com/products/11734> (KIT-11734) SparkFun ClockIt <https://www.sparkfun.com/products/10930> (KIT-10930) SparkFun Serial Enabled LCD Kit <https://www.sparkfun.com/products/10097> (LCD-10097) SparkFun Simon Tilts - Through Hole Soldering Kit <https://www.sparkfun.com/products/12634> (KIT-12634) SparkFun Frequency Counter Kit <https://www.sparkfun.com/products/10140> (KIT-10140) FabFM Radio Kit <https://www.sparkfun.com/products/11043> (KIT-11043) SparkFun Binary Blaster Kit <https://www.sparkfun.com/products/12037> (KIT-12037) SparkFun Metro-Gnome <https://www.sparkfun.com/products/9236> (KIT-09236) ATmega328 with Arduino Optiboot (Uno) <https://www.sparkfun.com/products/10524> (DEV-10524); PROD_ID: IC-09136
U2 = ece445:MCP3428
U3 = ece445:ACS723
U4 U5 = SparkFun-IC-Power:V_REG_LM1117: Voltage Regulator LM1117 Standard adjustable voltage regulator but in SMD form. Spark Fun Electronics SKU : COM-00595; PROD_ID: VREG-08170
U$1 = ece445:DC_JACK
Y1 = SparkFun-Clocks:CRYSTAL-16MHZ: 16MHz Crystal Digikey Example <http://www.digikey.com/product-search/en?keywords=535-9122-1-ND> Frequency: 16MHz Frequency Stability: ±50ppm Frequency Tolerance: ±20ppm Load Capacitance: 18pF SparkFun Products: Pro Micro -5V/16MHz <https://www.sparkfun.com/products/12640> SparkFun Serial Enabled LCD Kit <https://www.sparkfun.com/products/10097>; PROD_ID: XTAL-08181; SF_ID: COM-00536
Y2 = SparkFun-Clocks:CRYSTAL-16MHZ: 16MHz Crystal Digikey Example <http://www.digikey.com/product-search/en?keywords=535-9122-1-ND> Frequency: 16MHz Frequency Stability: ±50ppm Frequency Tolerance: ±20ppm Load Capacitance: 18pF SparkFun Products: Pro Micro -5V/16MHz <https://www.sparkfun.com/products/12640> SparkFun Serial Enabled LCD Kit <https://www.sparkfun.com/products/10097>; PROD_ID: XTAL-08181; SF_ID: COM-00536; VALUE: 16MHz

## Net classes
1 power: width 0.254 mm, drill 0.61 mm, clearance 0.203 mm
2 gnd: width 0.254 mm, drill 0.584 mm, clearance 0.254 mm

## Board
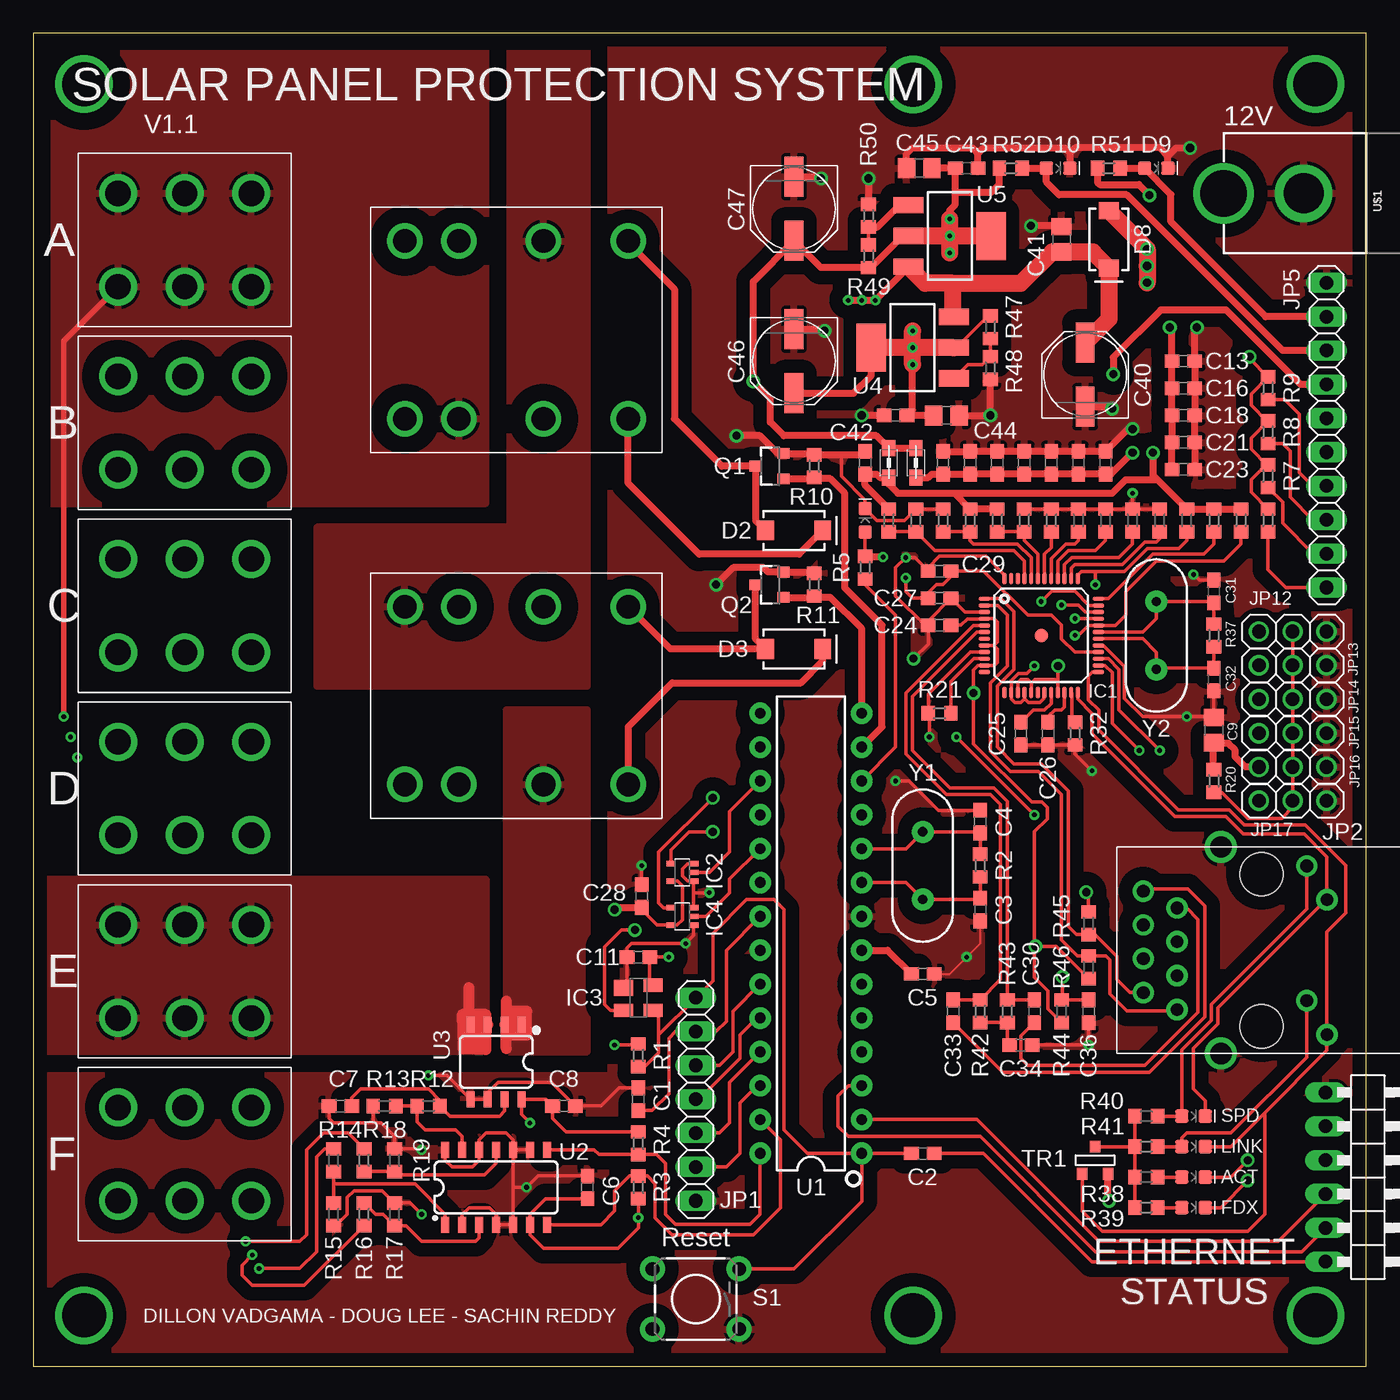
[diagram p5: board, top side]
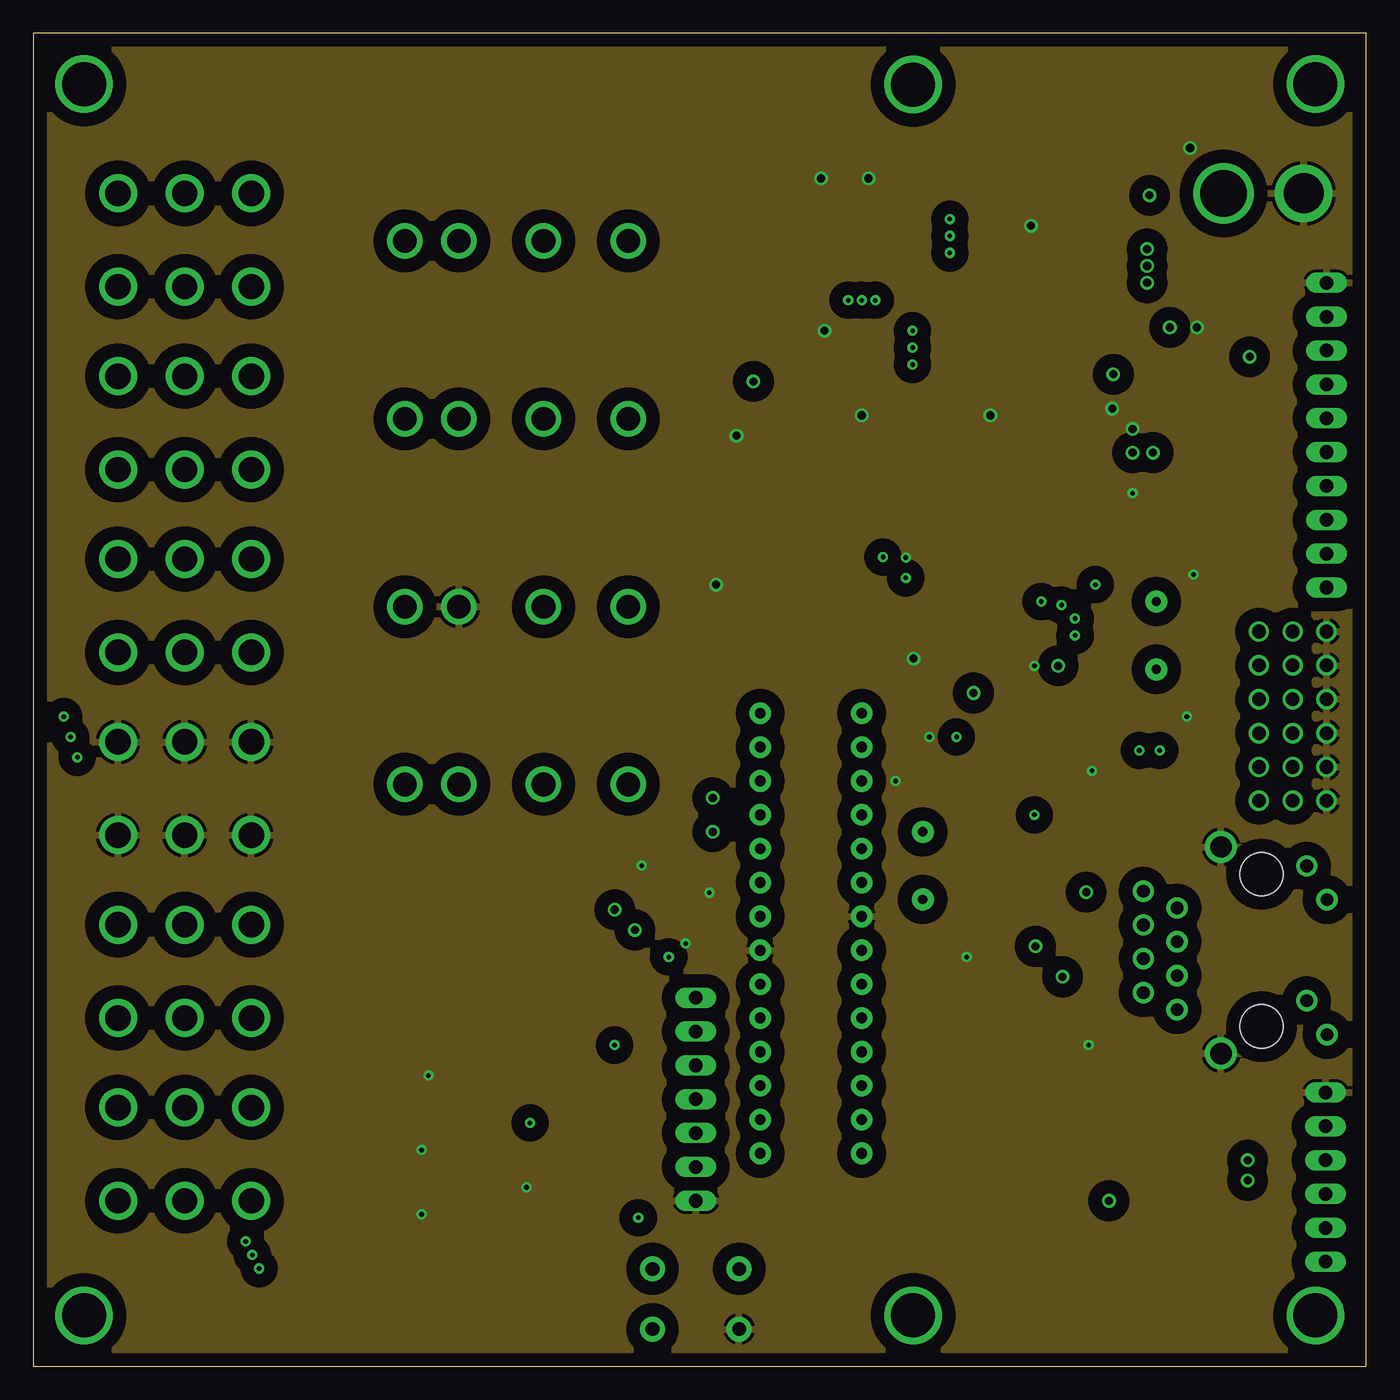
[diagram p6: board, inner layer Route2]
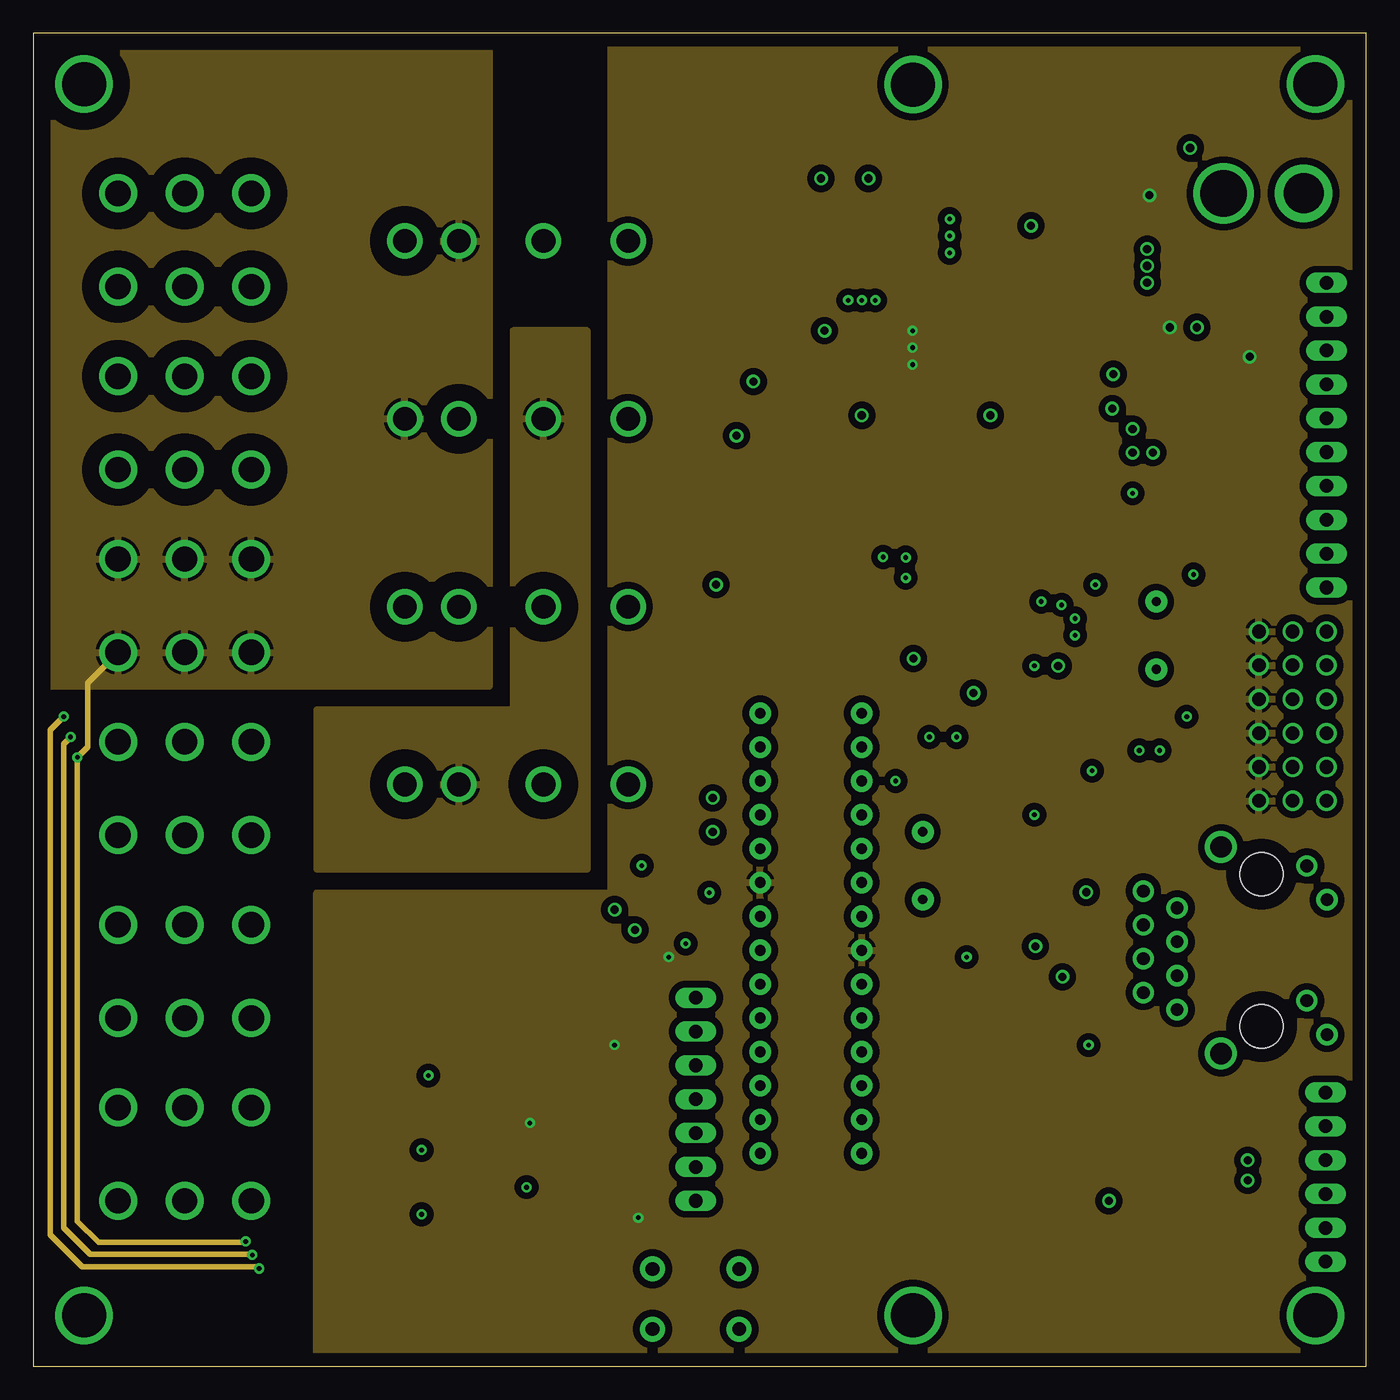
[diagram p7: board, inner layer Route15]
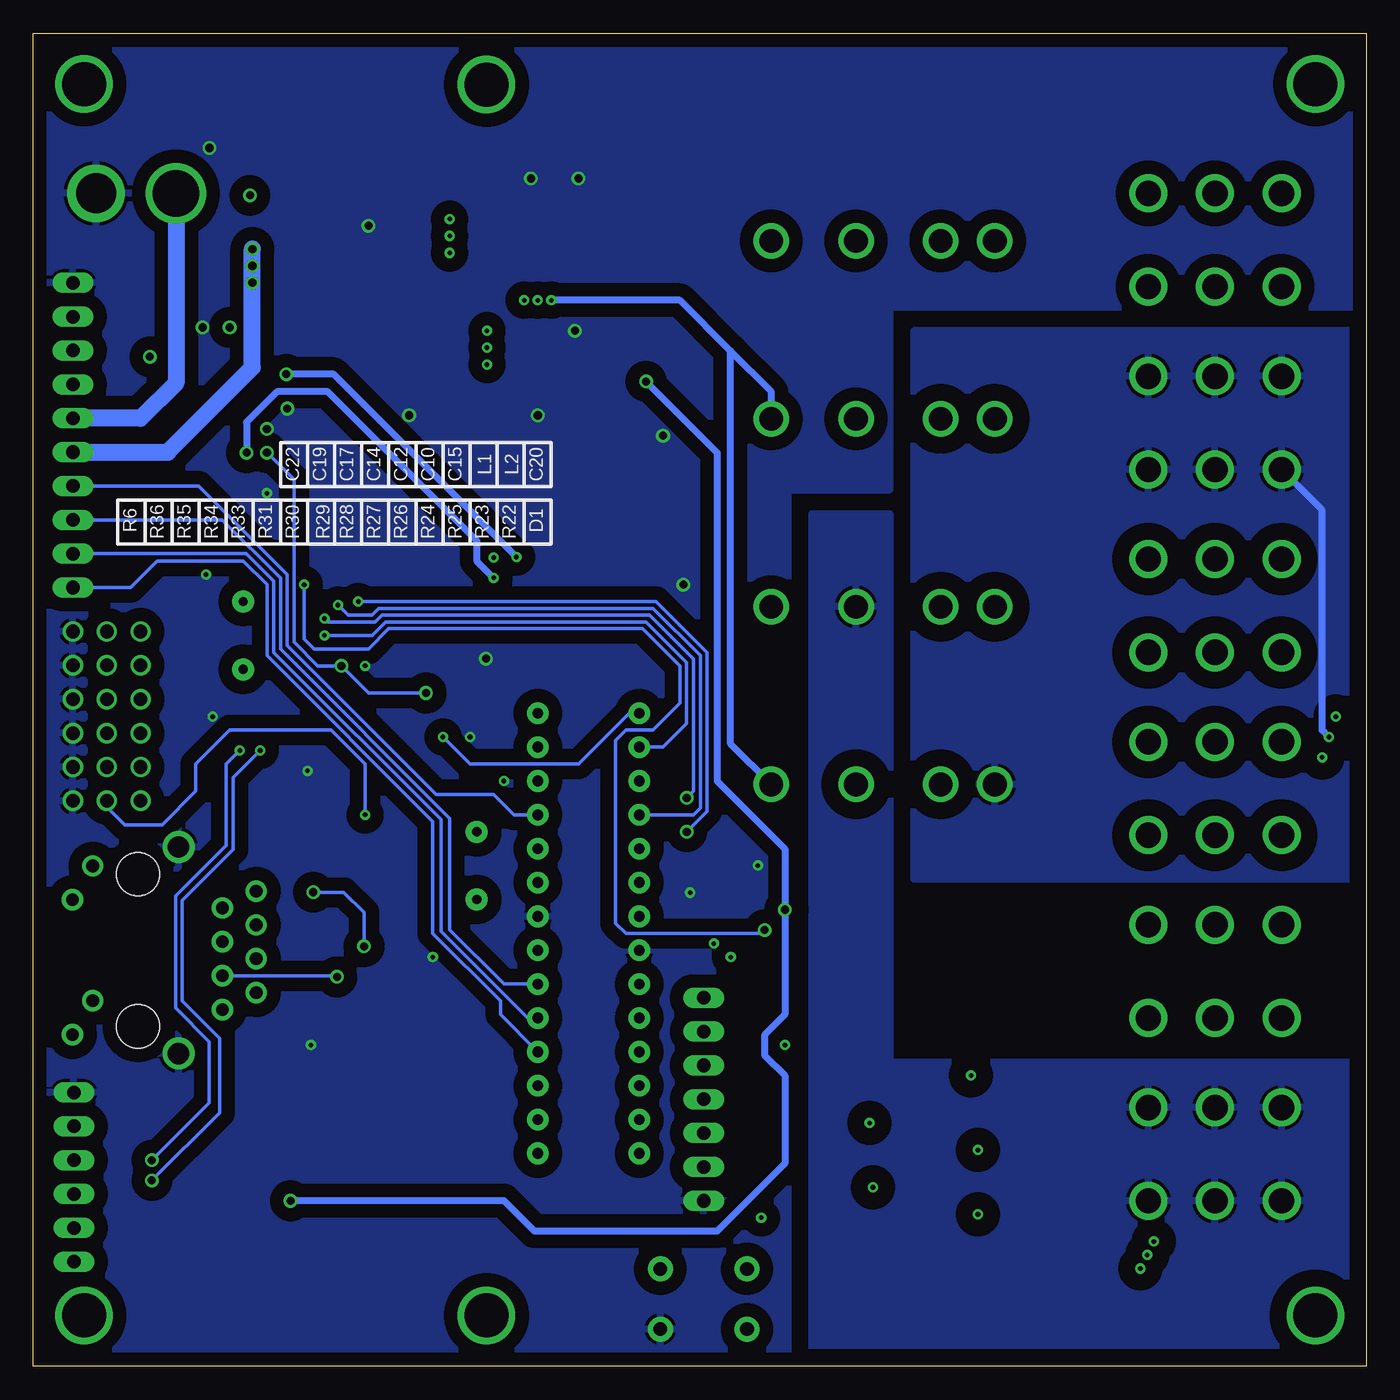
[diagram p8: board, bottom side, seen from below]

Size 100 x 100 mm. Coordinates in mm from the lower left corner, seen from the top.
Outline: 0,0 100,0 100,100 0,100 0,0
Copper layers (1+2*15+16): Top 0.035mm / dielectric 1.5mm / Route2 0.035mm / dielectric 0.15mm / Route15 0.035mm / dielectric 0.2mm / Bottom 0.035mm
Design rules "default *": minimum track width 6mil, minimum drill 0.35mm, track to track 6mil, track to pad 6mil, pad to pad 6mil, via to via 6mil, smd to smd 6mil, copper to edge 40mil, drill to drill 6mil, minimum pad ring 10mil, minimum via ring 8mil, stop-mask expansion 4mil, vias tented up to drill 0mil, thermal gap 10mil

### Footprints (pad centres in the part's own frame; a part is rotated, then mirrored left to right if it is on the bottom)
SCREW_TERM = drill 1.9: P$1 0,0; P$2 0,7; P$3 5,0; P$4 5,7; P$5 10,0; P$6 10,7
C0603 = smd 1.1 x 1: 1 -0.85,0; 2 0.85,0
C0805 = smd 1.3 x 1.5: 1 -0.95,0; 2 0.95,0
PANASONIC_D = smd 3 x 1.4: + 2.4,0; - -2.4,0
LED-0603 = smd 1 x 1: A -0.877,0; C 0.877,0
SMA-DIODE = smd 1.27 x 1.47: A -2.15,0; C 2.15,0
POE-RJ45 = drill 1.6: CH1 13.94,7.75; CH2 13.94,-7.75 | drill 0.95 pad 1.6: L1 7.51,-6.325; L2 5.99,-3.785; L3 7.51,3.785; L4 5.99,6.325; R1 17.23,4.445; R2 19.77,3.175; R3 17.23,1.905; R4 19.77,0.635; R5 17.23,-0.635; R6 19.77,-1.905; R7 17.23,-3.175; R8 19.77,-4.445 | hole 3.25: 10.89,5.715; 10.89,-5.715
TQFP48-7X7 = smd 0.85 x 0.32: 1 -4.275,2.75; 2 -4.275,2.25; 3 -4.275,1.75; 4 -4.275,1.25; 5 -4.275,0.75; 6 -4.275,0.25; 7 -4.275,-0.25; 8 -4.275,-0.75; 9 -4.275,-1.25; 10 -4.275,-1.75; 11 -4.275,-2.25; 12 -4.275,-2.75; 25 4.275,-2.75; 26 4.275,-2.25; 27 4.275,-1.75; 28 4.275,-1.25; 29 4.275,-0.75; 30 4.275,-0.25; 31 4.275,0.25; 32 4.275,0.75; 33 4.275,1.25; 34 4.275,1.75; 35 4.275,2.25; 36 4.275,2.75 | smd 0.32 x 0.85: 13 -2.75,-4.275; 14 -2.25,-4.275; 15 -1.75,-4.275; 16 -1.25,-4.275; 17 -0.75,-4.275; 18 -0.25,-4.275; 19 0.25,-4.275; 20 0.75,-4.275; 21 1.25,-4.275; 22 1.75,-4.275; 23 2.25,-4.275; 24 2.75,-4.275; 37 2.75,4.275; 38 2.25,4.275; 39 1.75,4.275; 40 1.25,4.275; 41 0.75,4.275; 42 0.25,4.275; 43 -0.25,4.275; 44 -0.75,4.275; 45 -1.25,4.275; 46 -1.75,4.275; 47 -2.25,4.275; 48 -2.75,4.275 | smd 1 x 1: P$1 0,0
SC70-5 = smd 0.4 x 0.7: 1 -0.65,-0.85; 2 0,-0.85; 3 0.65,-0.85; 4 0.65,0.85; 5 -0.65,0.85
SOT143 = smd 1.2 x 1.44: 1 -0.75,-1.1 | smd 1 x 1.44: 2 0.95,-1.1; 3 0.95,1.1; 4 -0.95,1.1
1X07 = drill 1.016 long: 1 -7.62,0; 2 -5.08,0; 3 -2.54,0; 4 0,0; 5 2.54,0; 6 5.08,0; 7 7.62,0
1X06/90 = drill 1.016 long: 1 -6.35,-3.81; 2 -3.81,-3.81; 3 -1.27,-3.81; 4 1.27,-3.81; 5 3.81,-3.81; 6 6.35,-3.81
1X10 = drill 1.016 long: 1 -11.43,0; 2 -8.89,0; 3 -6.35,0; 4 -3.81,0; 5 -1.27,0; 6 1.27,0; 7 3.81,0; 8 6.35,0; 9 8.89,0; 10 11.43,0
1X03 = drill 1.016: 1 -2.54,0; 2 0,0; 3 2.54,0
DPDT_RELAY = drill 1.778: 1A 0,16.764; 1B 0,12.7; 1Y 0,6.35; 2A 13.335,16.764; 2B 13.335,12.7; 2Y 13.335,6.35; IN+ 0,0; IN- 13.335,0
0805 = smd 1.2 x 1: 1 -1.1,0; 2 1.1,0
SOT23-3 = smd 0.8 x 0.9: 1 -0.95,-1; 2 0.95,-1; 3 0,1.1
R0603 = smd 1 x 1.1: 1 -0.85,0; 2 0.85,0
TACTILE_SWITCH_PTH_6.0MM = drill 1.016 pad 1.88: 1 -3.251,2.261; 2 3.251,2.261; 3 -3.251,-2.261; 4 3.251,-2.261
SOT-23 = smd 0.787 x 0.889: 1 0.025,-1.016; 2 -0.94,1.016; 3 0.991,1.016
DIP28 = drill 0.813 pad 1.626: 1 -16.51,-3.81; 2 -13.97,-3.81; 3 -11.43,-3.81; 4 -8.89,-3.81; 5 -6.35,-3.81; 6 -3.81,-3.81; 7 -1.27,-3.81; 8 1.27,-3.81; 9 3.81,-3.81; 10 6.35,-3.81; 11 8.89,-3.81; 12 11.43,-3.81; 13 13.97,-3.81; 14 16.51,-3.81; 15 16.51,3.81; 16 13.97,3.81; 17 11.43,3.81; 18 8.89,3.81; 19 6.35,3.81; 20 3.81,3.81; 21 1.27,3.81; 22 -1.27,3.81; 23 -3.81,3.81; 24 -6.35,3.81; 25 -8.89,3.81; 26 -11.43,3.81; 27 -13.97,3.81; 28 -16.51,3.81
SO14 = smd 0.6 x 1.2: 1 -3.81,-2.8; 2 -2.54,-2.8; 3 -1.27,-2.8; 4 0,-2.8; 5 1.27,-2.8; 6 2.54,-2.8; 7 3.81,-2.8; 8 3.81,2.8; 9 2.54,2.8; 10 1.27,2.8; 11 0,2.8; 12 -1.27,2.8; 13 -2.54,2.8; 14 -3.81,2.8
SO08 = smd 0.6 x 1.2: 1 -1.905,-2.8; 2 -0.635,-2.8; 3 0.635,-2.8; 4 1.905,-2.8; 5 1.905,2.8; 6 0.635,2.8; 7 -0.635,2.8; 8 -1.905,2.8
SOT223 = smd 1.219 x 2.235: 1 -2.311,-3.099; 2 0,-3.099; 3 2.311,-3.099 | smd 3.6 x 2.2: 4 0,3.099
POWER_JACK_PTH = drill 3 pad 4.318: GND 0,7.7 | drill 3.5: PWR 0,13.7
HC49US = drill 0.7 pad 1.651: 1 -2.54,0; 2 2.54,0

### Placement (x,y rotation side)
A  6.35,80.99 0 top
B  6.35,67.27 0 top
C  6.35,53.56 0 top
C1  45.39,20.03 90 top
C2  66.73,15.96 180 top
C3  71.04,34.25 270 top
C4  71.04,40.86 90 top
C5  66.73,29.43 0 top
C6  41.58,13.42 90 top
C7  23.04,19.52 180 top
C8  39.8,19.52 0 top
C9  88.57,47.71 90 top
C10  70.28,67.78 90 top
C11  45.39,30.7 180 top
C12  72.31,67.78 90 top
C13  86.28,75.4 0 top
C14  74.35,67.78 90 top
C15  68.25,67.78 90 top
C16  86.28,73.37 0 top
C17  76.38,67.78 90 top
C18  86.28,71.34 0 top
C19  78.41,67.78 90 top
C20  62.41,67.78 90 top
C21  86.28,69.3 0 top
C22  80.44,67.78 90 top
C23  86.28,67.27 0 top
C24  68,55.59 180 top
C25  74.09,47.46 270 top
C26  76.12,47.46 270 top
C27  68,59.65 180 top
C28  45.64,35.27 90 top
C29  68,57.62 0 top
C30  75.11,26.63 270 top
C31  88.57,58.13 90 top
C32  88.57,51.52 270 top
C33  69.01,26.63 270 top
C34  74.09,24.09 0 top
C36  79.17,26.63 270 top
C40  78.92,74.38 90 top
C41  77.14,84.54 90 top
C42  64.69,71.34 180 top
C43  70.03,89.88 0 top
C44  68.5,71.34 0 top
C45  66.47,89.88 180 top
C46  57.07,75.4 270 top
C47  57.07,86.83 270 top
D  6.35,39.84 0 top
D1  62.41,63.46 90 top
D2  57.07,62.7 0 top
D3  57.07,53.81 0 top
D4  87.05,14.19 0 top
D5  87.05,11.9 0 top
D6  87.05,18.76 0 top
D7  87.05,16.47 0 top
D8  80.7,84.54 270 top
D9  84.25,89.88 0 top
D10  76.89,89.88 0 top
E  6.35,26.12 0 top
ETH1  103.05,31.2 180 top
F  6.35,12.41 0 top
IC1  75.62,54.83 0 top
IC2  48.69,37.05 90 top
IC3  45.39,27.65 270 top
IC4  48.69,33.74 90 top
JP1  49.71,20.03 90 top
JP2  100.76,14.19 270 top
JP5  97.03,69.85 270 top
JP12  94.49,55.12 0 top
JP13  94.49,52.58 0 top
JP14  94.49,50.04 0 top
JP15  94.49,47.5 0 top
JP16  94.49,44.96 0 top
JP17  94.49,42.42 0 top
K1  44.63,71.08 90 top
K2  44.63,43.65 90 top
L1  66.22,67.78 270 top
L2  64.19,67.78 270 top
Q1  55.3,67.53 90 top
Q2  55.3,58.64 90 top
R1  45.39,23.33 90 top
R2  71.04,37.55 270 top
R3  45.39,13.42 270 top
R4  45.39,16.73 90 top
R5  62.41,59.91 270 top
R6  92.63,63.46 90 top
R7  92.63,66.76 90 top
R8  92.63,70.07 90 top
R9  92.63,73.37 90 top
R10  58.6,67.53 270 top
R11  58.6,58.64 270 top
R12  29.64,19.52 0 top
R13  26.34,19.52 0 top
R14  22.53,15.46 90 top
R15  22.53,11.39 90 top
R16  24.82,11.39 270 top
R17  27.1,11.39 270 top
R18  24.82,15.46 90 top
R19  27.1,15.46 270 top
R20  88.57,43.9 270 top
R21  68,48.98 0 top
R22  64.19,63.46 90 top
R23  66.22,63.46 270 top
R24  70.28,63.46 90 top
R25  68.25,63.46 270 top
R26  72.31,63.46 90 top
R27  74.35,63.46 270 top
R28  76.38,63.46 90 top
R29  78.41,63.46 90 top
R30  80.44,63.46 90 top
R31  82.47,63.46 90 top
R32  78.16,47.46 90 top
R33  84.51,63.46 90 top
R34  86.54,63.46 90 top
R35  88.57,63.46 90 top
R36  90.6,63.46 90 top
R37  88.57,54.83 90 top
R38  83.49,14.19 0 top
R39  83.49,11.9 0 top
R40  83.49,18.76 0 top
R41  83.49,16.47 0 top
R42  71.04,26.63 90 top
R43  73.08,26.63 90 top
R44  77.14,26.63 270 top
R45  79.17,33.24 270 top
R46  79.17,29.93 270 top
R47  71.81,77.94 90 top
R48  71.81,74.89 90 top
R49  62.66,83.27 270 top
R50  62.66,86.32 270 top
R51  80.7,89.88 180 top
R52  73.33,89.88 180 top
S1  49.71,5.04 180 top
TR1  79.68,15.46 180 top
U1  58.34,32.47 90 top
U2  34.72,13.42 0 top
U3  34.72,22.82 180 top
U4  65.96,76.42 90 top
U5  68.76,84.8 270 top
U$1  103,87.99 90 top
Y1  66.73,37.55 270 top
Y2  84.25,54.83 90 top

### Tracks (layer width: path | path; a pad name or v marks a point on that pad's centre or on a via)
1V2O
  Top 0.254: C26.1 76.12,48.73 76.63,49.24 77.14,49.24 77.37,49.46 IC1.22
3.3V  (via drill 0.35, 0.61)
  Top 0.254: C28.1 45.64,34.25 46.8,33.09 IC4.5 48.3,33.09 48.69,33.49 48.69,36.03 48.33,36.4 IC2.5
  Top 0.508: C45.1 C43.1 69.18,88.1 | U5.2 65.2,84.8 62.83,82.42 R49.2 59.08,82.42 C47.+ 54.03,81.38 v54.03,73.88 55.3,72.61 55.3,70.83 56.31,69.81 63.25,69.81 L2.1 L1.1 | v43.61,34.25 43.78,34.42 C28.1 | R52.2 72.48,88.67 71.86,88.05 69.23,88.05 69.18,88.1 | v80.7,12.41 80.62,12.48 TR1.2 | v68.76,86.07 68.76,86.73 69.18,87.15 69.18,88.1
  Top 1.27: U5.4 v68.76,84.8 | v68.76,84.8 U5.2 | v68.76,83.53 v68.76,84.8 | v68.76,84.8 v68.76,86.07
  Bottom 0.508: v54.03,73.88 48.69,68.54 48.69,43.9 43.61,38.82 v43.61,34.25 43.61,26.38 45.14,24.85 45.14,23.33 43.61,21.81 43.61,15.2 48.69,10.12 62.41,10.12 64.69,12.41 v80.7,12.41
3V3_LED
  Top 0.254: R41.1 R40.1 | TR1.1 R41.1 | R39.1 R38.1 R41.1
3V_LED
  Top 0.508: R52.1 D10.A 76.01,88.84 76.96,87.88 82.04,87.88 93.73,76.2 JP5.3
5V  (via drill 0.35, 0.61)
  Top 0.254: 69.43,76.42 69.27,76.42 | 69.27,76.42 U4.2 | R47.2 71.72,78.7 71.55,78.7 69.27,76.42 | U2.6 37.34,10.54 | U3.8 | U2.6 37.26,11.39 38.44,12.57 C6.1 | U3.8 38.45,20.02 C8.1 38.95,18.59 39.97,17.58 R4.2 | IC3.4 46.24,28.85 C11.1 v47.68,30.7 | R3.2 v45.39,11.14 45.39,10.38 43.87,8.85 38.28,8.85 37.26,9.87 U2.6 | v37.26,18.25 36.63,18.89 U3.8 | R1.2 45.3,24.09 v43.61,24.09 | R6.2 91.36,65.58 91.36,66.51 92.47,67.61 R7.2 92.55,67.61 91.36,68.8 91.36,69.65 R8.2 92.55,70.92 91.36,72.1 91.36,72.95 R9.2 91.26,75.59 v91.26,75.73
  Top 0.508: C44.1 C42.1 65.96,71.76 v65.96,75.15 | 65.54,76.33 65.46,76.42 | C46.+ 61.53,73 62.87,74.33 U4.4 | C23.1 C21.1 C18.1 C16.1 C13.1 85.43,77.77 v85.27,77.94 | 88.54,46.73 C9.1 | R20.1 88.54,44.78 88.54,46.73 | U1.7 64.1,31.2 C5.1 | JP16.1 90.93,44.96 90.17,45.72 90.17,46.23 89.66,46.74 88.55,46.74 88.54,46.73 | R51.2 79.85,88.81 80.01,88.65 82.94,88.65 v83.74,87.85
  Top 1.27: U4.2 v65.96,76.42 65.46,76.42 U4.4 | v65.96,75.15 v65.96,77.69
  pour Route15 (isolate 0.508): 43.36,102.32 101.52,102.32 101.52,-2.32 21.26,-2.32 21.26,35.52 43.36,35.52
5V_LED
  Top 0.508: R51.1 D9.A 85.34,87.91 85.34,85.85 92.46,78.74 JP5.2
12V  (via drill 0.35)
  Top 0.508: D2.C 57.45,60.92 49.96,60.92 44.63,66.26 K1.IN+ | K2.IN+ 44.63,47.97 47.93,51.27 57.58,51.27 59.22,52.91 D3.C | v61.14,79.97 v62.15,79.97 v63.17,79.97 65.66,82.46 U5.3
  Top 1.27: C40.+ 80.7,78.56 D8.C 79.5,83.59 C41.1 76.44,83.59 74.09,81.24 69.01,81.24 | U4.3 69.01,78.78 69.01,81.24 | 69.01,81.24 66.9,81.24 U5.3
  Bottom 0.508: K2.IN+ 47.68,46.7 47.68,76.16 | 47.68,76.16 51.49,79.97 v61.14,79.97 | K1.IN+ 44.63,73.11 47.68,76.16
+3V3A  (via drill 0.61)
  Top 0.254: C24.1 69.61,55.59 70.09,56.07 71.33,56.07 IC1.4 72.08,56.08 72.31,55.84 72.31,54.32 72.06,54.06 | 72.06,54.06 71.83,54.06 71.83,54.07 71.35,54.07 IC1.8 | 72.06,54.06 72.31,53.81 72.31,52.79 72.1,52.58 IC1.11 71.33,52.57 70.85,52.57 70.54,52.25 v70.54,50.51 70.54,46.7 74.91,42.33 75.66,42.33 76.07,41.91 76.07,41.07 75.11,40.11 75.11,31.5 | IC1.15 73.87,51.3 74.09,51.52 74.6,51.52 74.87,51.26 | 74.87,51.26 IC1.17 | IC1.21 76.87,51.29 | 76.87,51.29 76.63,51.52 75.13,51.52 74.87,51.26 | R44.2 76.12,26.8 76.12,28.16 75.11,29.17 75.11,31.5 | 76.87,51.29 76.87,52.52 v76.89,52.54 | R46.2 76.76,31.5 v75.18,31.5 75.11,31.5 | R45.1 79.17,35.38 v78.99,35.56
  Top 0.508: L1.2 67.15,66.68 67.4,66.93 C15.1 C10.1 C12.1 C14.1 C17.1 C19.1 C22.1 80.86,66.93 v82.47,68.54
  Bottom 0.254: v70.54,50.51 74.85,50.51 v76.89,52.54 78.66,52.54 80.44,54.32 80.44,66.51 v82.47,68.54 | v75.18,31.5 75.18,34.04 76.71,35.56 v78.99,35.56
+3V3D  (via drill 0.35, 0.61)
  Top 0.254: IC1.28 78.14,53.58 77.14,54.57 77.14,55.59 76.38,56.35 74.6,56.35 71.3,59.65 C27.1 68.85,59.23 68.25,58.64 67.74,58.64 67.15,58.04 C29.1 65.96,57.62 65.46,58.13 v65.46,59.14
  Top 0.508: R26.2 R24.2 69.1,65.49 | 69.1,65.49 64.86,65.49 64.19,66.17 L2.2 63.51,66.68 63.26,66.93 C20.1 62.41,66.09 R22.2 | R36.2 R35.2 R34.2 84.34,66.51 | 69.1,65.49 80.95,65.49 81.97,66.51 84.34,66.51 | v84,68.54 84,66.85 84.34,66.51
  Bottom 0.508: v65.46,59.14 66.73,60.41 66.73,61.94 77.9,73.11 81.71,73.11 84,70.83 v84,68.54
+12V
  Bottom 1.27: U$1.PWR 89.3,73.77 91.95,71.12 JP5.5
ACT  (via drill 0.35, 0.61)
  Top 0.254: D4.C 89.84,14.19 v91.11,15.46 | IC1.27 80.67,53.08 81.46,52.29 81.46,49.24 v84.51,46.19
  Bottom 0.254: v91.11,15.46 86.79,19.77 86.79,24.35 89.33,26.89 89.33,35.27 85.52,39.08 85.52,45.17 v84.51,46.19
ADC0
  Top 0.254: JP1.5 51.49,22.57 52.5,23.58 52.5,26.63 U1.23
ADC1
  Top 0.254: JP1.4 49.96,20.03 53.01,23.08 53.01,24.85 54.28,26.12 U1.24
ADC2
  Top 0.254: JP1.3 51.49,17.49 52.25,18.25 52.25,21.3 U1.25
ADC3
  Top 0.254: JP1.2 51.99,14.95 53.01,15.96 53.01,19.77 54.28,21.04 U1.26
AREF
  Top 0.254: U1.21 51.99,31.2 51.99,25.87 51.23,25.11 JP1.6 48.18,25.11 47.68,24.6 47.68,20.45 46.41,19.18 C1.1
CONFIG1
  Top 0.254: JP5.10 93.98,58.42 92.63,59.77 R6.1
  Bottom 0.254: U1.4 64.95,26.38 64.95,27.39 70.03,32.47 70.03,40.86 82.47,53.3 82.47,58.64 84.25,60.41 90.72,60.41 92.71,58.42 JP5.10
CONFIG2
  Top 0.254: JP5.9 96.01,60.96 93.73,63.25 93.73,64.82 R7.1
  Bottom 0.254: U1.5 62.92,26.12 69.42,32.63 69.42,41.01 81.97,53.56 81.97,58.89 84.04,60.96 JP5.9
CONFIG3
  Top 0.254: R8.1 93.74,69.22 94.3,68.65 94.3,65.21 96.01,63.5 JP5.8
  Bottom 0.254: U1.6 64.69,28.66 68.76,32.73 68.76,41.11 81.46,53.81 81.46,59.14 85.81,63.5 JP5.8
DTR
  Top 0.254: JP2.6 79.43,7.84 71.3,15.96 C2.1
FDXLED  (via drill 0.35, 0.61)
  Top 0.254: D5.C 89.08,11.9 v91.11,13.93 | v82.98,46.19 80.95,48.22 80.95,52.03 80.41,52.58 IC1.26
  Bottom 0.254: v91.11,13.93 86.03,19.01 86.03,24.6 88.82,27.39 88.82,34.95 85.01,38.76 85.01,44.16 v82.98,46.19
GND  (via drill 0.35, 0.61)
  Top 0.152: C5.2 68.76,29.43 v70.03,30.7 71.04,31.71 C3.2
  Top 0.254: U2.10 U2.9 | U2.14 30.91,15.46 31.42,14.95 32.94,14.95 33.45,15.46 U2.12 33.45,16.98 33.96,17.49 35.48,17.49 35.99,16.98 U2.10 | U2.2 32.18,11.39 32.69,11.9 34.21,11.9 34.72,11.39 U2.4 U2.5 35.99,13.42 | R13.1 25.49,18.25 | C7.2 22.19,18.59 22.53,18.25 25.49,18.25 | 25.49,18.25 26.09,18.25 27.1,17.23 R19.1 29.05,16.31 v29.13,16.22 | 35.99,13.42 U2.10 | C1.2 43.95,20.88 42.6,19.52 C8.2 38.87,21.3 34.85,21.3 34.09,20.53 U3.6 U3.5 31.03,21.81 v29.64,21.81 | IC3.1 44.54,28.65 C11.2 44.54,31.37 44.88,31.71 v48.95,31.71 49.54,32.31 IC4.1 | v79.43,44.67 78.16,45.94 R32.1 C26.2 C25.2 | R15.1 22.7,10.54 23.55,11.39 23.55,12.66 24.05,13.17 26.17,13.17 R17.1 28.28,12.24 v29.13,11.39 | C6.2 37.86,14.27 v37.01,13.42 35.99,13.42 | 49.54,35.52 IC2.1 49.09,36.4 48.69,36.79 48.69,37.3 49.09,37.7 IC2.3 | 49.54,35.52 IC4.3 | v50.72,35.52 49.54,35.52 | C28.2 v45.64,37.55 | C34.2 v79.17,24.09 C36.2 | C4.2 67.91,41.71 65.71,43.9 v64.69,43.9 | C9.2 88.57,48.73 | 88.57,48.73 C32.2 | 88.57,48.73 v86.54,48.73 83.24,48.73 81.86,50.1 81.86,52.51 80.3,54.08 IC1.29 | IC1.9 70.3,53.58 67.15,50.42 R21.1 67.23,48.9 v67.23,47.21 | 74.36,50.06 74.09,49.8 73.64,49.8 73.38,50.06 IC1.14 73.37,51.45 73.9,51.98 74.55,51.98 v75.11,52.54 | 74.36,50.06 74.36,50.54 IC1.16 | IC1.19 75.81,50.49 75.81,50.09 75.52,49.8 74.64,49.8 74.38,50.06 74.36,50.06 | IC1.48 72.87,59.35 71.45,60.77 68,60.77 67.15,59.92 C27.2 66.13,60.67 v65.46,60.67 64.69,59.91 64.69,57.79 66.89,55.59 C24.2 | IC1.3 69.89,56.58 C29.2 67.15,55.92 C24.2 | v87.05,59.4 87.47,58.98 C31.2 | 60.88,68.38 60.63,68.12 60.63,66.76 62.41,64.99 D1.C 63.28,63.46 65.37,63.46 R23.1 R25.1
  Top 0.254: R27.1 R28.2 R29.2 R30.2 R31.2 | R31.2 R33.2 | R31.2 v82.47,65.49 | v66.04,53.09 67.15,54.19 C24.2
  Top 0.508: R11.1 58.5,59.59 Q2.2 55.11,59.59 54.79,59.91 52.5,59.91 v51.23,58.64 | C23.2 C21.2 C18.2 C16.2 C13.2 87.13,77.77 v87.3,77.94 | C15.2 C10.2 C12.2 C14.2 C17.2 C19.2 C22.2 82.13,70.32 v82.47,70.32 | v52.76,69.81 54.53,69.81 55.87,68.48 Q1.2 58.5,68.48 R10.1 60.88,68.38 62.15,68.38 C20.2 | C46.- 59.25,77.8 v59.36,77.69 | C47.- 58.99,89.23 v59.11,89.12 | D9.C 85.13,90.78 | 85.13,90.78 84.51,91.4 78.16,91.4 77.76,91.01 | 77.76,91.01 D10.C | C43.2 70.88,90.98 | 70.88,90.98 71.3,91.4 77.37,91.4 77.76,91.01 | C45.2 65.52,90.96 65.96,91.4 70.46,91.4 70.88,90.98 | v62.66,89.12 R50.1 | 85.13,90.78 85.75,91.4 v86.79,91.4 | C41.2 77.07,85.56 v74.85,85.56 | C44.2 v71.81,71.34 R48.1 | C40.- 80.81,71.98 v80.95,71.84 | C42.2 v62.15,71.34
  pour Top (isolate 1.016): 43.36,101.31 100.51,101.31 100.51,-1.31 -0.51,-1.31 -0.51,21.81 43.36,21.81
  pour Route2 (isolate 1.016): -1.02,101.82 101.02,101.82 101.02,-1.82 -1.02,-1.82
  pour Bottom (isolate 1.016): -2.03,79.46 -2.03,102.83 102.03,102.83 102.03,-2.83 43.36,-2.83 43.36,65.75 35.74,65.75 35.74,79.46
I_SENSE
  Top 0.254: R13.2 R12.1 28.79,18.34 29.39,17.74 31.67,17.74 32.18,17.23 U2.13
INT
  Top 0.254: IC1.36 80.65,57.58 84,60.92 87.81,60.92 88.57,61.68 R35.1
INTERFACE_OUT+
  Top 0.813: U3.4 U3.3 | 33.45,24.35 33.2,26.38 | 32.69,24.09 32.69,28.41 | 33.96,23.77 33.96,26.38 32.18,26.38 32.26,23.84 33.96,23.77
  pour Top (isolate 0.152): -0.51,36.54 33.96,36.54 33.96,23.58 -0.51,23.58
INTERFACE_OUT-
  pour Bottom (isolate 1.27): -0.51,22.82 -0.51,-1.31 41.58,-1.31 41.58,63.97 35.74,63.97 35.74,22.82
LINKLED
  Top 0.254: D7.C 89.84,16.47 92.38,19.01 | 92.38,19.01 97.06,23.69 ETH1.L4 97.06,32.58 98.48,34 98.48,37.55 95.43,40.6 90.86,40.6 89.71,41.74 85.9,41.74 79.93,47.71 79.93,49.24 79.17,50 79.17,51.78 79.47,52.08 IC1.25 | TR1.3 78.69,11.62 80.19,10.12 91.11,10.12 92.38,11.39 92.38,19.01
MISO  (via drill 0.35)
  Top 0.254: IC1.34 78.95,56.58 78.41,57.11 v77.14,57.11
  Bottom 0.254: U1.18 50.47,41.36 49.96,41.87 49.96,53.3 53.52,56.86 74.09,56.86 74.6,56.35 76.38,56.35 v77.14,57.11
MOSI
  Top 0.254: IC2.2 50.72,37.05 52.25,38.57 52.25,41.62 U1.17
MOSI3  (via drill 0.35, 0.61)
  Top 0.254: IC1.35 79.21,57.08 78.13,58.15 76.4,58.15 v75.62,57.37 | IC2.4 47.84,38.74 49.2,40.09 v50.98,40.09
  Bottom 0.254: v50.98,40.09 49.45,41.62 49.45,53.56 53.26,57.37 v75.62,57.37
N$2
  Top 0.254: R47.1 R48.2 71.21,75.15 70.1,75.15 U4.1
N$3
  Top 0.254: R49.1 R50.2
  Top 0.508: R50.2 63.34,85.47 64.97,87.11 U5.1
N$6
  Top 0.254: U1.9 65.46,36.28 Y1.2 70.96,35.01 C3.1 R2.2
N$7  (via drill 3.3)
  other vias: 66,3.81
N$8
  Top 0.254: U1.10 65.46,38.82 Y1.1 70.96,40.09 C4.1 R2.1
N$9
  Top 0.254: U1.12 64.69,46.44 64.69,56.35 62.41,58.64 R5.2
N$15
  pour Route15 (isolate 1.27): 35.99,77.69 35.99,49.24 21.26,49.24 21.26,37.3 41.58,37.3 41.58,77.69
N$16
  pour Top (isolate 1.27): 35.74,101.31 35.74,62.95 21.26,62.95 21.26,51.02 41.58,51.02 41.58,101.31
N$17
  Top 0.254: IC1.31 83.23,55.08 84.25,56.1 Y2.2 88.48,57.37 C31.1 R37.2
N$18
  Top 0.508: D2.A 54.2,63.43 Q1.3 51.66,67.53 48.1,71.08 48.1,80.82 44.63,84.29 K1.IN-
N$19
  Top 0.254: IC1.39 77.37,60.13 77.9,60.67 81.46,60.67 82.47,61.68 R31.1
N$20
  Top 0.254: R38.2 D4.A
N$21
  Top 0.508: Q2.3 54.2,54.54 D3.A 47.8,53.81 K2.IN-
N$22
  Top 0.254: C7.1 23.89,20.12 24.56,20.79 29.64,20.79 30.49,19.94 R12.2 31.25,18.76 34.98,18.76 35.36,19.14 U3.7
N$23  (via drill 3.3)
  other vias: 3.81,96.19
N$24
  Top 0.254: IC1.23 77.9,50.52 77.9,48.56 R32.2
N$25
  Top 0.254: R41.2 D7.A 86.17,17.12 86.54,17.49 89.84,17.49 95.54,23.19 ETH1.L3
N$26
  Top 0.254: R40.2 D6.A 86.17,23.72 88.39,25.95 88.39,27.14 95.54,34.29 ETH1.L1
N$27
  Top 0.254: R42.1 R43.1 73.08,24.26 C34.1
N$28
  Top 0.254: C30.2 74.09,24.77 74.09,23.08 74.6,22.57 83.41,22.57 87.38,26.54 87.38,33.53 86.53,34.38 ETH1.R7
N$29
  Top 0.254: C33.2 72.73,22.06 83.74,22.06 87.88,26.2 87.88,34.54 86.61,35.81 83.44,35.81 ETH1.R8
N$30
  Top 0.254: D5.A R39.2
N$31
  Top 0.254: IC1.40 76.87,60.39 77.65,61.18 79.68,61.18 80.44,61.94 R30.1
N$32  (via drill 3.3)
  other vias: 3.81,3.81
N$33  (via drill 3.3)
  other vias: 96.19,3.81
N$34  (via drill 3.3)
  other vias: 96.19,96.19
N$35
  Top 0.254: IC1.41 76.37,60.59 77.46,61.68 78.16,61.68 78.41,61.94 R29.1
N$36  (via drill 0.61)
  Top 0.254: C36.1 R44.1 77.22,27.56 v77.22,29.21
  Bottom 0.254: ETH1.R3 77.31,29.3 v77.22,29.21
N$37
  Top 0.254: IC1.42 75.87,60.92 76.38,61.43 R28.1
N$38
  Top 0.254: C25.1 75.02,49.24 75.87,49.24 76.37,49.73 IC1.20
N$39
  Top 0.254: IC1.38 77.87,59.87 78.16,60.16 81.71,60.16 83.4,61.85 84.25,61.85 84.51,62.1 R33.1
N$40
  Top 0.254: IC1.10 70.56,53.08 68.85,51.36 R21.2
N$41  (via drill 3.3)
  other vias: 66,96.16
OSC2E2
  Top 0.254: IC1.30 83.23,54.58 84.25,53.56 Y2.1 84.34,52.37 C32.1 R37.1
OUTPUT_EN
  Top 0.254: R9.1 93.9,72.52 95,71.43 95,67.06 96.01,66.04 JP5.7
  Bottom 0.254: U1.11 63.93,41.36 65.46,42.89 69.77,42.89 80.95,54.06 80.95,59.4 87.59,66.04 JP5.7
OUTPUT_LED  (via drill 0.35, 0.61)
  Top 0.254: D1.A R5.1
  Top 0.508: R5.1 63.7,60.76 v63.75,60.71 | JP5.4 95.08,73.66 89.49,79.25 84.58,79.25 81.03,75.69 v81.03,74.42
  Bottom 0.508: v63.75,60.71 77.47,74.42 v81.03,74.42
PANEL_A  (via drill 0.35)
  Top 0.254: R14.2 21.86,16.31 21.26,15.71 21.26,8.6 19.99,7.33 v16.94,7.33
  Top 0.406: v2.29,48.73 2.29,76.92 A.P$1
  Route15 0.406: v2.29,48.73 1.27,47.71 1.27,9.87 3.67,7.47 16.8,7.47 v16.94,7.33
  pour Top (isolate 1.27): -0.51,101.31 -0.51,64.73 33.96,64.73 33.96,101.31
PANEL_B  (via drill 0.35)
  Top 0.254: R16.2 20.33,6.06 16.43,6.06 15.67,6.82 15.67,7.58 v16.43,8.34
  Route15 0.406: v2.79,47.21 2.29,46.7 2.29,10.38 4.28,8.38 16.4,8.38 v16.43,8.34
  Bottom 0.508: v2.79,47.21 3.3,47.71 3.3,64.22 B.P$1
  pour Bottom (isolate 1.27): -0.51,77.69 33.96,77.69 33.96,36.54 -0.51,36.54
PANEL_C  (via drill 0.35)
  Top 0.254: R18.2 23.63,17.49 21.77,17.49 20.5,16.22 20.5,9.87 19.99,9.36 v15.93,9.36
  Route15 0.406: C.P$1 4.06,51.27 4.06,46.44 v3.3,45.68 3.3,10.88 4.89,9.3 15.86,9.3 v15.93,9.36
  pour Route15 (isolate 1.27): -0.51,51.02 34.21,51.02 34.21,101.31 -0.51,101.31
PMODE0
  Top 0.254: R22.1 R23.2 67.65,61.18 73.58,61.18 74.37,60.39 IC1.45
PMODE1
  Top 0.254: R25.2 R24.1 70.28,61.94 70.54,61.68 73.84,61.68 74.87,60.66 IC1.44
PMODE2
  Top 0.254: R26.1 R27.2 74.35,61.94 75.37,60.92 IC1.43
PWR1  (via drill 0.61)
  Top 1.27: v83.57,81.28 v83.57,82.55 v83.57,83.82 D8.A
  Bottom 1.27: JP5.6 89.92,68.58 83.57,74.93 v83.57,83.82
RELAY_0
  Top 0.508: Q1.1 58.5,66.58 | 58.5,66.58 R10.2 | U1.13 63.68,47.97 63.68,55.59 60.88,58.38 60.88,65.49 59.8,66.58 58.5,66.58
RELAY_1
  Top 0.508: Q2.1 58.5,57.69 | 58.5,57.69 R11.2 | U1.14 62.15,55.33 59.8,57.69 58.5,57.69
RELAY_OUT+
  Top 0.813: U3.1 U3.2 35.48,25.75 | 35.48,26.63 35.48,24.85 37.01,24.85 37.01,26.63 35.48,26.63 | 35.48,26.63 36.25,24.85 36.25,26.38 35.48,26.63 | 35.48,23.84 35.48,25.75 | 35.48,27.39 35.48,25.75
  pour Top (isolate 1.27): 35.48,49.24 35.48,23.58 41.58,23.58 41.58,49.24
RESET
  Top 0.254: R1.1 45.9,22.48 46.91,23.5 46.91,24.85 | 46.91,24.85 JP1.7 50.98,28.92 50.98,32.47 53.52,35.01 55.55,35.01 56.31,34.25 56.31,17.74 58.09,15.96 U1.1 | IC3.3 46.91,26.27 46.91,24.85 | U1.1 C2.2 | S1.3 57.09,7.3 62.15,12.37 U1.1
RESET_W  (via drill 0.35, 0.61)
  Top 0.254: R34.1 86.54,61.94 85.93,61.33 83.58,61.33 81.86,59.61 79.68,59.61 | 79.68,59.61 78.62,59.61 78.37,59.35 IC1.37 | v79.68,58.64 79.68,59.61 | IC3.2 43.29,26.7 42.85,27.14 42.85,31.46 44.12,32.73 v45.14,32.73
  Bottom 0.254: v45.14,32.73 45.39,32.47 55.55,32.47 56.31,33.24 56.31,46.95 55.55,47.71 53.52,47.71 51.49,49.75 51.49,52.54 54.28,55.33 73.33,55.33 74.85,53.81 78.92,53.81 79.68,54.57 v79.68,58.64
RXD
  Top 0.254: JP2.4 93.4,9.36 79.93,9.36 70.79,18.5 U1.2
RXIN
  Top 0.254: IC1.5 70.52,55.58 65.46,50.51 65.46,45.94 68.5,42.89 71.81,42.89 72.57,42.13 72.57,29.01 R42.2 C33.1
RXIP
  Top 0.254: IC1.6 70.79,55.08 65.96,50.25 65.96,46.19 68.76,43.4 72.06,43.4 73.08,42.38 R43.2 C30.1
SCK
  Top 0.254: IC4.2 50.47,33.74 52.25,35.52 52.25,36.54 U1.19
SCK3  (via drill 0.35, 0.61)
  Top 0.254: IC1.33 78.18,56.08 v78.16,56.1 | IC4.4 47.28,34.39 46.91,34.76 46.91,38.57 v50.98,42.63
  Bottom 0.254: v50.98,42.63 50.47,43.14 50.47,53.05 53.77,56.35 73.84,56.35 74.35,55.84 77.9,55.84 v78.16,56.1
SCL
  Top 0.254: U2.8 42.08,16.22 42.43,15.88 R4.1 46.75,15.88 47.42,15.2 47.42,11.39 48.18,10.63 53.77,10.63 54.53,11.39 U1.28
SDA
  Top 0.254: U2.7 42.59,10.62 43.61,11.65 43.61,13.17 44.72,14.27 R3.1 46.06,14.27 46.66,13.68 46.66,11.14 47.93,9.87 54.03,9.87 56.06,11.9 56.06,16.98 U1.27
SPDLED
  Top 0.254: D6.C 87.92,19.91 87.05,20.79 87.05,23.84 88.88,25.67 88.88,26.89 96.98,34.99 ETH1.L2 97.06,38.21 95.34,39.92 90.77,39.92 89.46,41.24 85.65,41.24 79.43,47.46 79.43,48.98 78.37,50.04 IC1.24
SS  (via drill 0.35)
  Top 0.254: R36.1 90.6,61.68 89.33,60.41 84.25,60.41 81.97,58.13 81.97,56.35 81.19,55.58 IC1.32 79.16,55.58 78.41,54.83 v78.16,54.83
  Bottom 0.254: U1.16 52.76,46.44 50.98,48.22 50.98,52.79 54.03,55.84 73.58,55.84 74.6,54.83 v78.16,54.83
T_SENSE  (via drill 0.35)
  Top 0.254: R20.2 89.17,43.05 91.11,41.11 93.65,41.11 94.49,41.95 JP17.2 JP16.2 JP15.2 JP14.2 JP13.2 JP12.2 | v69.27,47.21 v75.11,41.36
  Bottom 0.254: v69.27,47.21 67.23,45.17 59.11,45.17 55.3,48.98 U1.15 | v75.11,41.36 75.11,45.17 77.65,47.71 85.27,47.71 87.81,45.17 87.81,43.14 90.35,40.6 93.14,40.6 94.49,41.95 JP17.2
TXD
  Top 0.254: U1.3 61.14,21.04 60.38,20.28 60.38,18 61.14,17.23 71.04,17.23 79.68,8.6 95.17,8.6 JP2.5
TXON
  Top 0.254: IC1.1 72.61,57.58 73.58,56.6 73.58,52.29 72.31,51.02 72.31,46.44 73.58,45.17 75.62,45.17 77.65,43.14 77.65,32.98 78.24,32.39 R45.2 79.63,32.39 81.28,30.73 81.28,29.01 82.26,28.03 ETH1.R2
TXOP
  Top 0.254: IC1.2 72.35,57.08 73.08,56.35 73.08,52.54 71.81,51.27 71.81,46.12 73.3,44.63 75.39,44.63 77.14,42.89 77.14,31.97 78.32,30.78 R46.1 80.47,30.78 80.77,30.48 80.77,27.94 82.04,26.67 85.73,26.67 ETH1.R1
V_SENSE_A
  Top 0.254: R14.1 22.53,13.68 | 22.53,13.68 R15.2 | 22.53,13.68 28.63,13.68 30.91,11.39 U2.1
V_SENSE_B
  Top 0.254: U2.3 33.45,9.61 33.2,9.36 29.13,9.36 27.95,10.54 R17.2 26.25,11.39 25.67,11.39 R16.1
V_SENSE_C
  Top 0.254: R18.1 R19.2 27.36,14.35 33.87,14.35 34.72,15.2 U2.11

### Text on the board
tNames: SOLAR PANEL PROTECTION SYSTEM | 12V | V1.1 | SPD | LINK | ACT | FDX | Reset | ETHERNET / STATUS | DILLON VADGAMA - DOUG LEE - SACHIN REDDY